# Altium project Inverter.PrjPcb
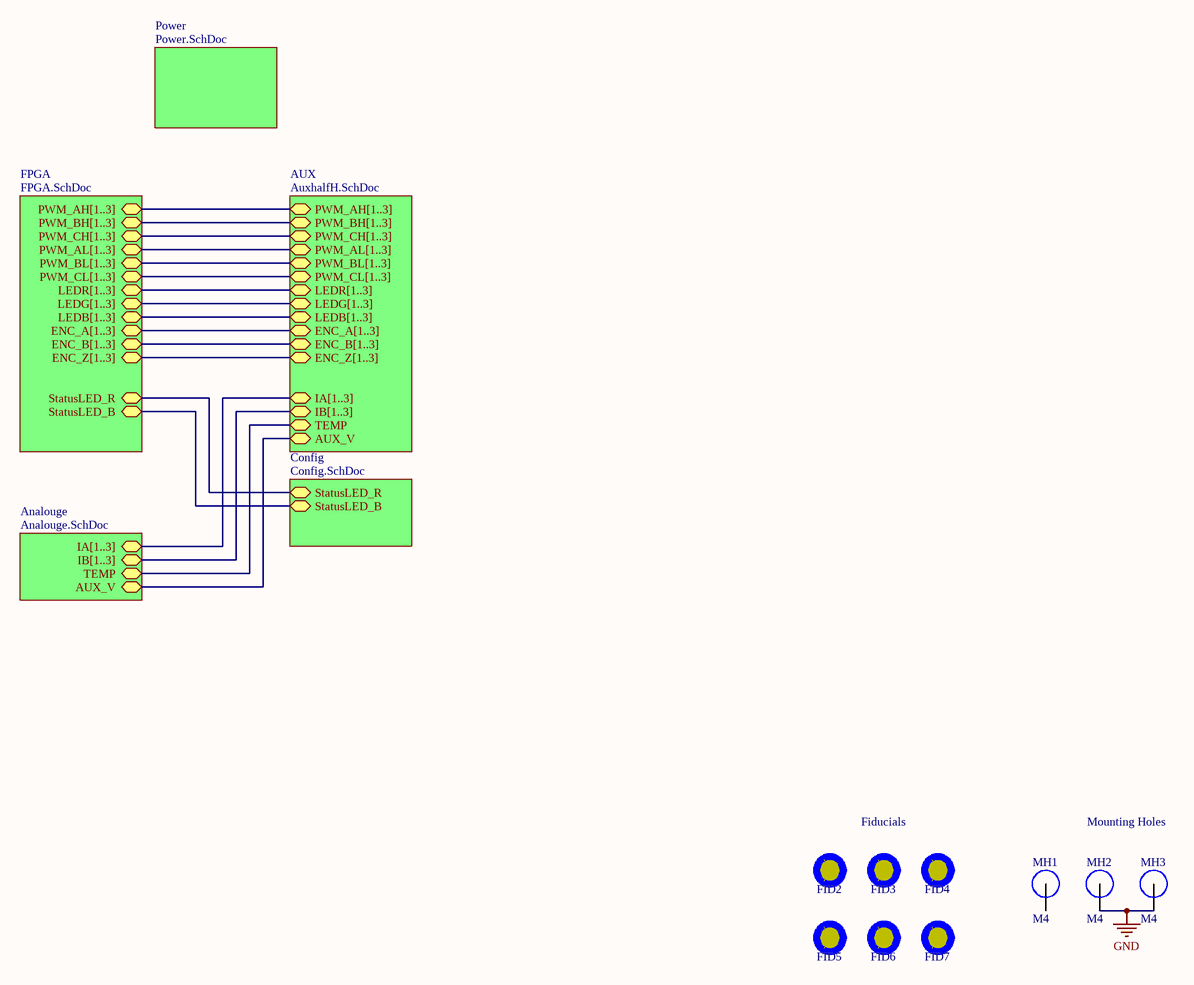
[diagram p0: Top.SchDoc]
7 sheets, 301 parts. Net scope: hierarchical (ports join the sheet entries above them; power ports are global).
Board file: Inverter.PcbDoc
Sheets:
  Top.SchDoc
    AUX = AuxhalfH.SchDoc
      M1 = M0.SchDoc
      M2 = M0.SchDoc
      M3 = M0.SchDoc
    Analouge = Analouge.SchDoc
    FPGA = FPGA.SchDoc
    Config = Config.SchDoc
    Power = Power.SchDoc

## Sheet Top.SchDoc
size A3

### Parts
FID2  FIDUCIAL  [FIDUCIAL]  (value not drawn)
FID3  FIDUCIAL  [FIDUCIAL]  (value not drawn)
FID4  FIDUCIAL  [FIDUCIAL]  (value not drawn)
FID5  FIDUCIAL  [FIDUCIAL]  (value not drawn)
FID6  FIDUCIAL  [FIDUCIAL]  (value not drawn)
FID7  FIDUCIAL  [FIDUCIAL]  (value not drawn)
MH1  M4  [MH_M4]
MH2  M4  [MH_M4]
MH3  M4  [MH_M4]

### Sub-sheets
Analouge = Analouge.SchDoc: AUX_V, IA[1..3], IB[1..3], TEMP
AUX = AuxhalfH.SchDoc: PWM_AH[1..3], PWM_BH[1..3], PWM_CH[1..3], PWM_AL[1..3], PWM_BL[1..3], PWM_CL[1..3], LEDR[1..3], LEDG[1..3], LEDB[1..3], ENC_A[1..3], ENC_B[1..3], ENC_Z[1..3], IA[1..3], IB[1..3], AUX_V, TEMP
Config = Config.SchDoc: StatusLED_B, StatusLED_R
FPGA = FPGA.SchDoc: PWM_AH[1..3], PWM_BH[1..3], PWM_CH[1..3], PWM_AL[1..3], PWM_BL[1..3], PWM_CL[1..3], LEDR[1..3], LEDG[1..3], LEDB[1..3], ENC_A[1..3], ENC_B[1..3], ENC_Z[1..3], StatusLED_B, StatusLED_R
Power = Power.SchDoc: no entries

### Nets
GND: MH2.1 MH3.1
StatusLED_B: sheet FPGA/StatusLED_B, sheet Config/StatusLED_B
StatusLED_R: sheet FPGA/StatusLED_R, sheet Config/StatusLED_R
NetR18_1: sheet AUX/AUX_V, sheet Analouge/AUX_V
NetR19_1: sheet AUX/TEMP, sheet Analouge/TEMP

Not connected (* = marked no-connect by the designer): MH1 1

### Buses and harness runs
bus sheet Analouge/IA[1..3] = sheet AUX/IA[1..3]
bus sheet Analouge/IB[1..3] = sheet AUX/IB[1..3]
bus sheet AUX/ENC_A[1..3] = sheet FPGA/ENC_A[1..3]
bus sheet AUX/ENC_B[1..3] = sheet FPGA/ENC_B[1..3]
bus sheet AUX/ENC_Z[1..3] = sheet FPGA/ENC_Z[1..3]
bus sheet AUX/LEDB[1..3] = sheet FPGA/LEDB[1..3]
bus sheet AUX/LEDG[1..3] = sheet FPGA/LEDG[1..3]
bus sheet AUX/LEDR[1..3] = sheet FPGA/LEDR[1..3]
bus sheet AUX/PWM_AH[1..3] = sheet FPGA/PWM_AH[1..3]
bus sheet AUX/PWM_AL[1..3] = sheet FPGA/PWM_AL[1..3]
bus sheet AUX/PWM_BH[1..3] = sheet FPGA/PWM_BH[1..3]
bus sheet AUX/PWM_BL[1..3] = sheet FPGA/PWM_BL[1..3]
bus sheet AUX/PWM_CH[1..3] = sheet FPGA/PWM_CH[1..3]
bus sheet AUX/PWM_CL[1..3] = sheet FPGA/PWM_CL[1..3]

### Notes on the sheet
- Fiducials
- Mounting Holes

### Library data of the parts
FID2-FID7 = FIDUCIAL: 1mm Fiducial with 2mm soldermask, 3mm keepout
MH1-MH3 = MH_M4: M4 Mounting Hole

## Sheet AuxhalfH.SchDoc
size A3; DocumentNumber: 4; SheetNumber: 4; SheetTotal: 8
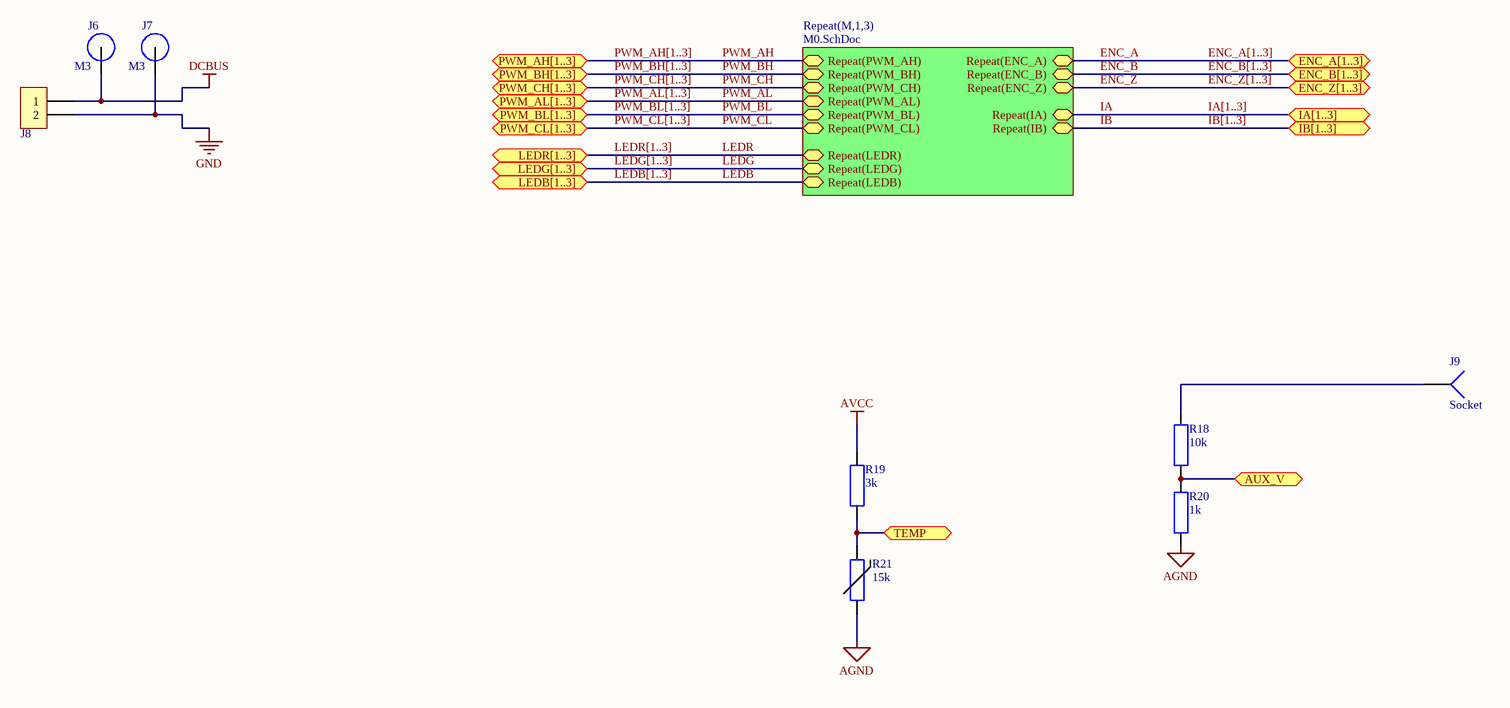
[diagram p1: AuxhalfH.SchDoc]

### Parts
J6  M3  [M3 Spade Hole]
J7  M3  [M3 Spade Hole]
J8  MC000232  [MC000232]  (value not drawn)
J9  Socket  [PIN1]
R18  value 10k  [RESC1608X06L]  (hidden comment: MCMR06X1002FTL)
R19  value 3k  [RESC1608X55N]  (hidden comment: MCMR06X3001FTL)
R20  value 1k  [RESC1608X55N]  (hidden comment: MCMR06X1001FTL)
R21  value 15k  [RESC1608X06L]  (hidden comment: NTCS0603E3153JMT)

### Sub-sheets
Repeat(M,1,3) = M0.SchDoc: Repeat(PWM_CH), Repeat(PWM_BH), Repeat(ENC_A), Repeat(PWM_AH), Repeat(ENC_B), Repeat(PWM_CL), Repeat(ENC_Z), Repeat(PWM_BL), Repeat(PWM_AL), Repeat(IA), Repeat(IB), Repeat(LEDR), Repeat(LEDG), Repeat(LEDB)

### Ports
AUX_V, ENC_A[1..3], ENC_B[1..3], ENC_Z[1..3], IA[1..3], IB[1..3], LEDB[1..3], LEDG[1..3], LEDR[1..3], PWM_AH[1..3], PWM_AL[1..3], PWM_BH[1..3], PWM_BL[1..3], PWM_CH[1..3], PWM_CL[1..3], TEMP

### Nets
AGND: R20.1 R21.1
AVCC: R19.2
DCBUS: J6.1 J8.1
GND: J7.1 J8.2
ENC_A: sheet Repeat(M,1,3)/Repeat(ENC_A)
ENC_B: sheet Repeat(M,1,3)/Repeat(ENC_B)
ENC_Z: sheet Repeat(M,1,3)/Repeat(ENC_Z)
IA: sheet Repeat(M,1,3)/Repeat(IA)
IB: sheet Repeat(M,1,3)/Repeat(IB)
LEDB: sheet Repeat(M,1,3)/Repeat(LEDB)
LEDG: sheet Repeat(M,1,3)/Repeat(LEDG)
LEDR: sheet Repeat(M,1,3)/Repeat(LEDR)
PWM_AH: sheet Repeat(M,1,3)/Repeat(PWM_AH)
PWM_AL: sheet Repeat(M,1,3)/Repeat(PWM_AL)
PWM_BH: sheet Repeat(M,1,3)/Repeat(PWM_BH)
PWM_BL: sheet Repeat(M,1,3)/Repeat(PWM_BL)
PWM_CH: sheet Repeat(M,1,3)/Repeat(PWM_CH)
PWM_CL: sheet Repeat(M,1,3)/Repeat(PWM_CL)
NetJ9_1: J9.1 R18.2
NetR18_1: R18.1 R20.2 ; port AUX_V
NetR19_1: R19.1 R21.2 ; port TEMP

### Buses and harness runs
bus ENC_A[1..3] = port ENC_A[1..3]
bus ENC_B[1..3] = port ENC_B[1..3]
bus ENC_Z[1..3] = port ENC_Z[1..3]
bus IA[1..3] = port IA[1..3]
bus IB[1..3] = port IB[1..3]
bus LEDB[1..3] = port LEDB[1..3]
bus LEDG[1..3] = port LEDG[1..3]
bus LEDR[1..3] = port LEDR[1..3]
bus PWM_AH[1..3] = port PWM_AH[1..3]
bus PWM_AL[1..3] = port PWM_AL[1..3]
bus PWM_BH[1..3] = port PWM_BH[1..3]
bus PWM_BL[1..3] = port PWM_BL[1..3]
bus PWM_CH[1..3] = port PWM_CH[1..3]
bus PWM_CL[1..3] = port PWM_CL[1..3]

### Library data of the parts
J6 J7 = M3 Spade Terminal
J8 = MC000232: TERMINAL BLOCK, WIRE TO BRD, 2POS, 6AWG; Supplier 1: Farnell; Supplier Part Number 1: 2008224
R18 = MCMR06X1002FTL: Resistor, 10k, 0603; Supplier 1: Farnell; Supplier Part Number 1: 2073349; Supplier 2: Farnell; Supplier Part Number 2: 2073349RL
R19 = MCMR06X3001FTL: RESISTOR, 0603, 3K, 1%, ANTI SULFUR; Supplier 1: Farnell; Supplier Part Number 1: 2073461; Supplier 2: Farnell; Supplier Part Number 2: 2073461RL
R20 = MCMR06X1001FTL: RESISTOR, CERAMIC, 1K, 0.1W, 1%; Supplier 1: Farnell; Supplier Part Number 1: 2073348; Supplier 2: Farnell; Supplier Part Number 2: 2073348RL
R21 = NTCS0603E3153JMT: THERMISTOR, 15K, 5%, SMD, NTC
J9 = Socket: LatestRevisionDate: 17-Jul-2002; LatestRevisionNote: Re-released for DXP Platform.; Publisher: Altium Limited

## Sheet M0.SchDoc
size A3; DocumentNumber: 1; SheetNumber: 1; SheetTotal: 8
Used 3 times, as channels AUX/M1, AUX/M2, AUX/M3. Parts and nets are listed once, with the designators drawn on the sheet.
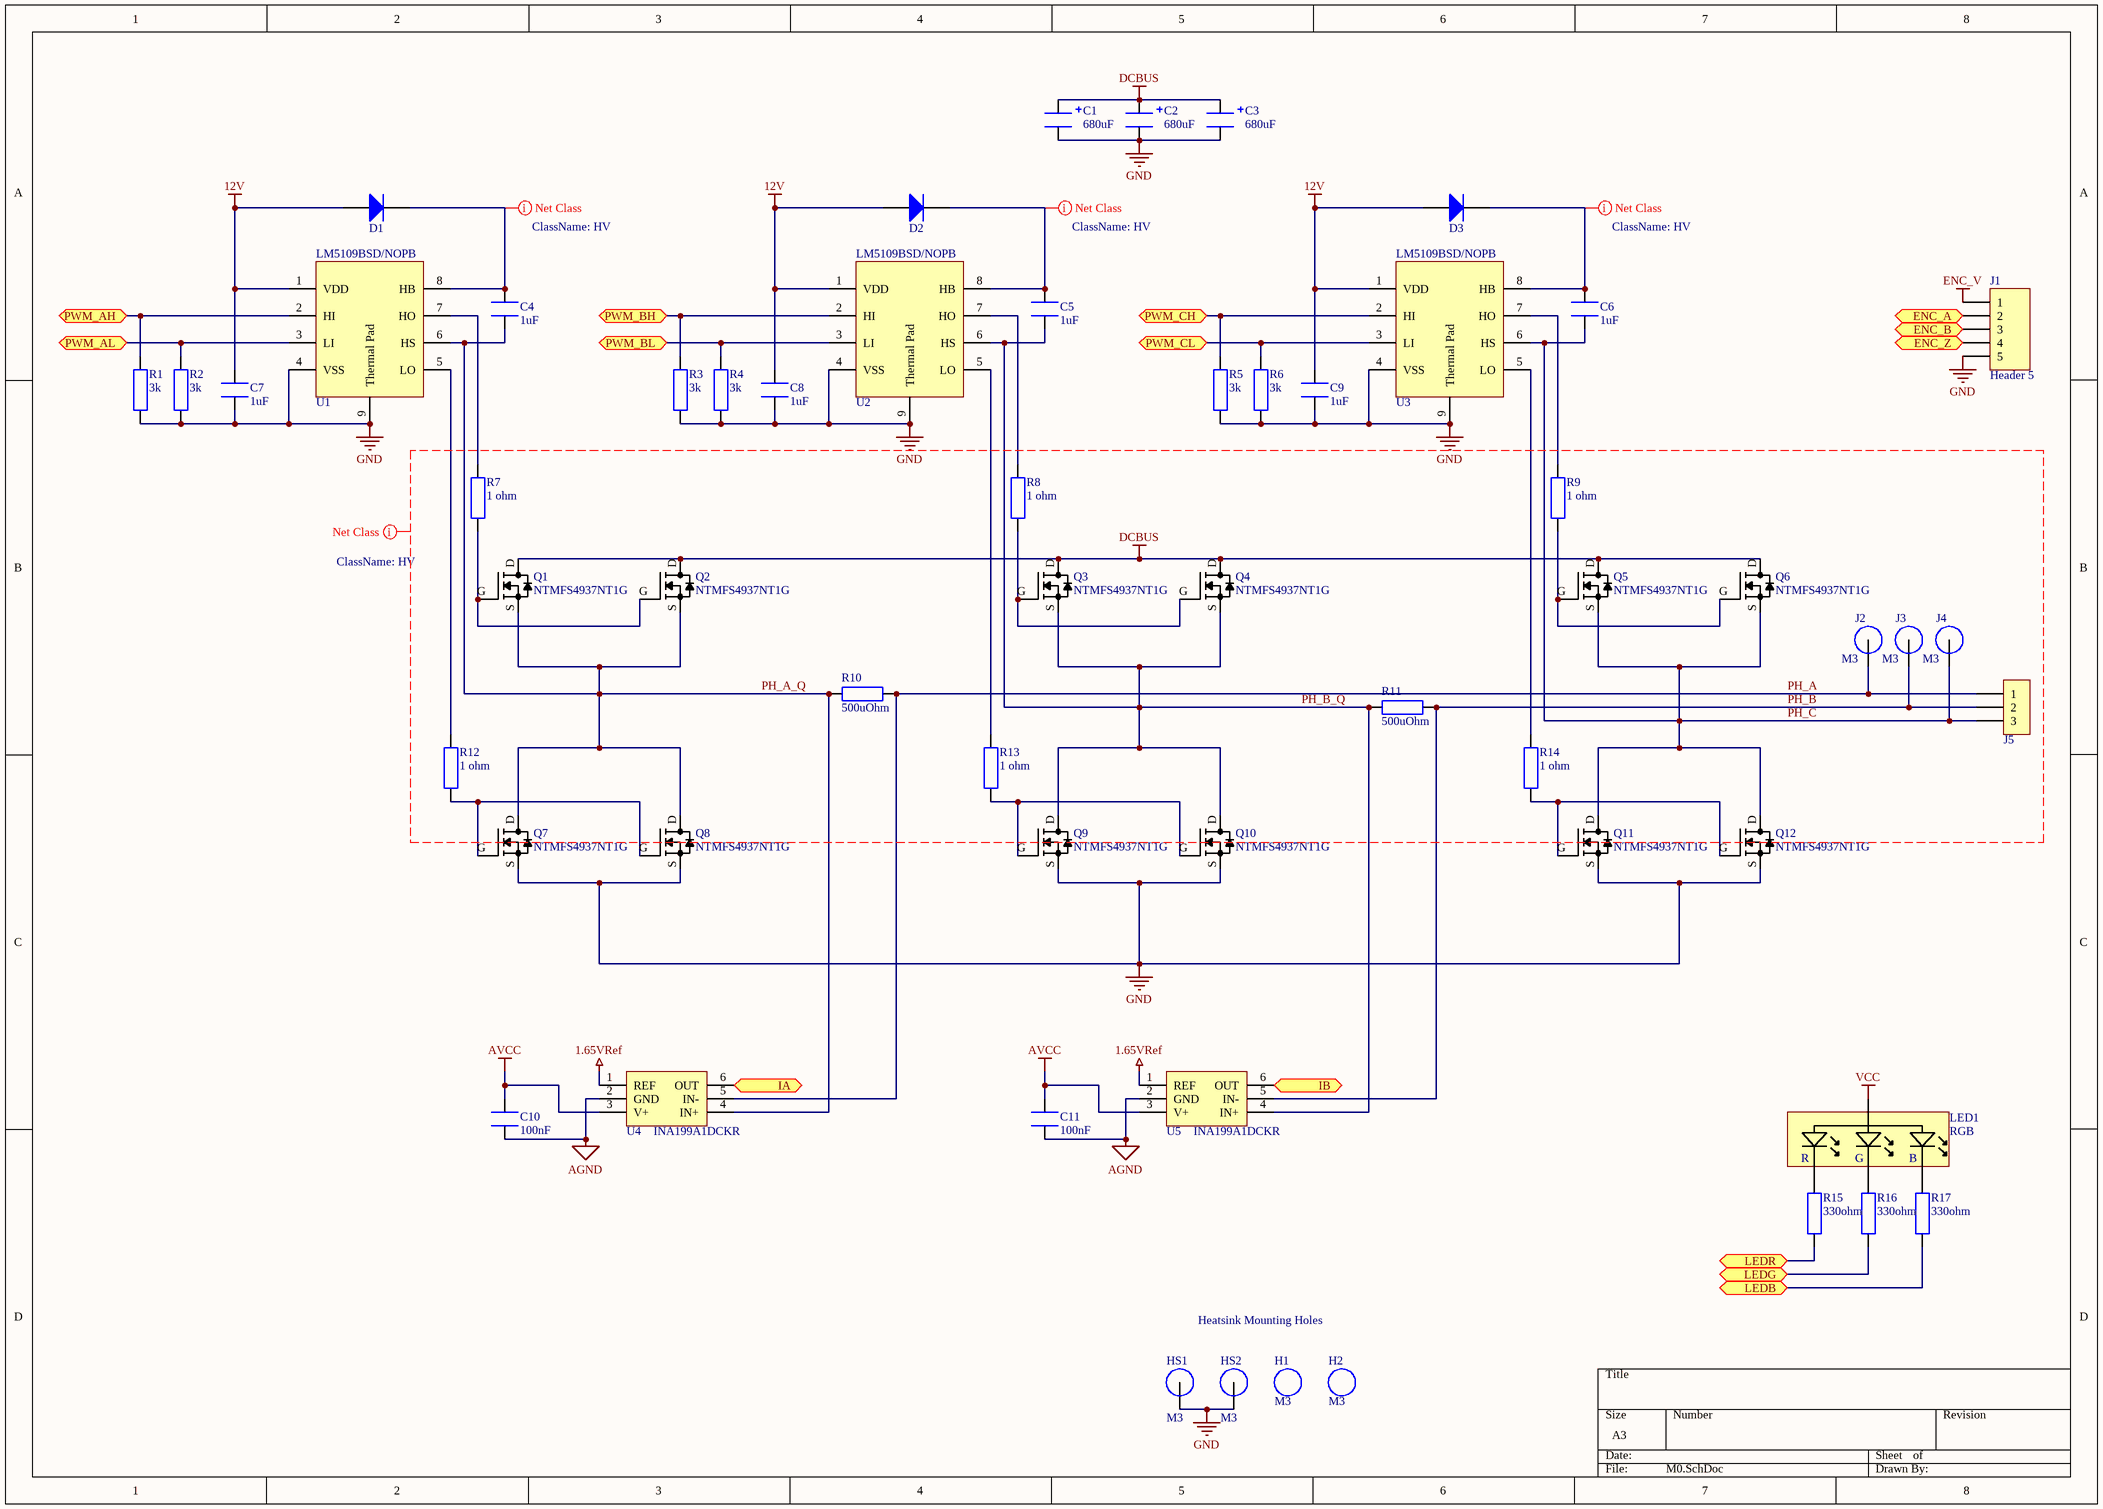
[diagram p2: M0.SchDoc]

### Parts
C1  value 680uF  [CAPE10.0MM_Rad_10x14mm]  (hidden comment: 35ZLH680MEFC10X23)
C2  value 680uF  [CAPE10.0MM_Rad_10x14mm]  (hidden comment: 35ZLH680MEFC10X23)
C3  value 680uF  [CAPE10.0MM_Rad_10x14mm]  (hidden comment: 35ZLH680MEFC10X23)
C4  value 1uF  [1608[0603]]  (hidden comment: MC0603X105K160)
C5  value 1uF  [1608[0603]]  (hidden comment: MC0603X105K160)
C6  value 1uF  [1608[0603]]  (hidden comment: MC0603X105K160)
C7  value 1uF  [1608[0603]]  (hidden comment: MC0603X105K160)
C8  value 1uF  [1608[0603]]  (hidden comment: MC0603X105K160)
C9  value 1uF  [1608[0603]]  (hidden comment: MC0603X105K160)
C10  value 100nF  [1608[0603]]  (hidden comment: MC0603B104K160CT)
C11  value 100nF  [1608[0603]]  (hidden comment: MC0603B104K160CT)
D1  RB521S30T1G  [SOD523F]  (value not drawn)
D2  RB521S30T1G  [SOD523F]  (value not drawn)
D3  RB521S30T1G  [SOD523F]  (value not drawn)
H1  M3  [M3 Hole]
H2  M3  [M3 Hole]
HS1  M3  [M3 Mounting Hole]
HS2  M3  [M3 Mounting Hole]
J1  Header 5  [HDR1X5]
J2  M3  [M3 Spade Hole]
J3  M3  [M3 Spade Hole]
J4  M3  [M3 Spade Hole]
J5  MC000051  [MC000051]  (value not drawn)
LED1  RGB  [ASMB-MTB1]
Q1  NTMFS4937NT1G  [SO8FL_FILL]
Q2  NTMFS4937NT1G  [SO8FL_FILL]
Q3  NTMFS4937NT1G  [SO8FL_FILL]
Q4  NTMFS4937NT1G  [SO8FL_FILL]
Q5  NTMFS4937NT1G  [SO8FL_FILL]
Q6  NTMFS4937NT1G  [SO8FL_FILL]
Q7  NTMFS4937NT1G  [SO8FL_FILL]
Q8  NTMFS4937NT1G  [SO8FL_FILL]
Q9  NTMFS4937NT1G  [SO8FL_FILL]
Q10  NTMFS4937NT1G  [SO8FL_FILL]
Q11  NTMFS4937NT1G  [SO8FL_FILL]
Q12  NTMFS4937NT1G  [SO8FL_FILL]
R1  value 3k  [RESC1608X55N]  (hidden comment: MCMR06X3001FTL)
R2  value 3k  [RESC1608X55N]  (hidden comment: MCMR06X3001FTL)
R3  value 3k  [RESC1608X55N]  (hidden comment: MCMR06X3001FTL)
R4  value 3k  [RESC1608X55N]  (hidden comment: MCMR06X3001FTL)
R5  value 3k  [RESC1608X55N]  (hidden comment: MCMR06X3001FTL)
R6  value 3k  [RESC1608X55N]  (hidden comment: MCMR06X3001FTL)
R7  value 1 ohm  [RESC1608X55N]  (hidden comment: MCWR06W1R00FTL)
R8  value 1 ohm  [RESC1608X55N]  (hidden comment: MCWR06W1R00FTL)
R9  value 1 ohm  [RESC1608X55N]  (hidden comment: MCWR06W1R00FTL)
R10  value 500uOhm  [RESC6332X70N]  (hidden comment: TLR3A20DR0005FTDG)
R11  value 500uOhm  [RESC6332X70N]  (hidden comment: TLR3A20DR0005FTDG)
R12  value 1 ohm  [RESC1608X55N]  (hidden comment: MCWR06W1R00FTL)
R13  value 1 ohm  [RESC1608X55N]  (hidden comment: MCWR06W1R00FTL)
R14  value 1 ohm  [RESC1608X55N]  (hidden comment: MCWR06W1R00FTL)
R15  value 330ohm  [RESC1608X06L]  (hidden comment: MCWR06X3300FTL)
R16  value 330ohm  [RESC1608X06L]  (hidden comment: MCWR06X3300FTL)
R17  value 330ohm  [RESC1608X06L]  (hidden comment: MCWR06X3300FTL)
U1  LM5109BSD/NOPB  [SON80P400X80_HS-9N]
U2  LM5109BSD/NOPB  [SON80P400X80_HS-9N]
U3  LM5109BSD/NOPB  [SON80P400X80_HS-9N]
U4  INA199A1DCKR  [TSOP65P210X110-6N]
U5  INA199A1DCKR  [TSOP65P210X110-6N]

### Ports
ENC_A, ENC_B, ENC_Z, IA, IB, LEDB, LEDG, LEDR, PWM_AH, PWM_AL, PWM_BH, PWM_BL, PWM_CH, PWM_CL

### Nets
1.65VRef: U4.1(REF) U5.1(REF)
12V: C7.2 C8.2 C9.2 D1.A D2.A D3.A U1.1(VDD) U2.1(VDD) U3.1(VDD)
AGND: C10.1 C11.1 U4.2(GND) U5.2(GND)
AVCC: C10.2 C11.2 U4.3(V+) U5.3(V+)
DCBUS: C1.1 C2.1 C3.1 Q1.D Q2.D Q3.D Q4.D Q5.D Q6.D
ENC_V: J1.1
GND: C1.2 C2.2 C3.2 C7.1 C8.1 C9.1 HS1.1 HS2.1 J1.5 Q7.S Q8.S Q9.S Q10.S Q11.S Q12.S R1.1 R2.1 R3.1 R4.1 R5.1 R6.1 U1.4(VSS) U1.9(Thermal_Pad) U2.4(VSS) U2.9(Thermal_Pad) U3.4(VSS) U3.9(Thermal_Pad)
VCC: LED1.4(A)
ENC_A: J1.2 ; port ENC_A
ENC_B: J1.3 ; port ENC_B
ENC_Z: J1.4 ; port ENC_Z
IA: U4.6(OUT) ; port IA
IB: U5.6(OUT) ; port IB
LEDB: R17.2 ; port LEDB
LEDG: R16.2 ; port LEDG
LEDR: R15.2 ; port LEDR
PH_A: J2.1 J5.1 R10.1 U4.5(IN-)
PH_A_Q: C4.1 Q1.S Q2.S Q7.D Q8.D R10.2 U1.6(HS) U4.4(IN+)
PH_B: J3.1 J5.2 R11.1 U5.5(IN-)
PH_B_Q: C5.1 Q3.S Q4.S Q9.D Q10.D R11.2 U2.6(HS) U5.4(IN+)
PH_C: C6.1 J4.1 J5.3 Q5.S Q6.S Q11.D Q12.D U3.6(HS)
PWM_AH: R1.2 U1.2(HI) ; port PWM_AH
PWM_AL: R2.2 U1.3(LI) ; port PWM_AL
PWM_BH: R3.2 U2.2(HI) ; port PWM_BH
PWM_BL: R4.2 U2.3(LI) ; port PWM_BL
PWM_CH: R5.2 U3.2(HI) ; port PWM_CH
PWM_CL: R6.2 U3.3(LI) ; port PWM_CL
NetC4_2: C4.2 D1.K U1.8(HB)
NetC5_2: C5.2 D2.K U2.8(HB)
NetC6_2: C6.2 D3.K U3.8(HB)
NetLED1_1: LED1.1(R) R15.1
NetLED1_2: LED1.2(G) R16.1
NetLED1_3: LED1.3(B) R17.1
NetQ1_G: Q1.G Q2.G R7.1
NetQ3_G: Q3.G Q4.G R8.1
NetQ5_G: Q5.G Q6.G R9.1
NetQ7_G: Q7.G Q8.G R12.1
NetQ9_G: Q9.G Q10.G R13.1
NetQ11_G: Q11.G Q12.G R14.1
NetR7_2: R7.2 U1.7(HO)
NetR8_2: R8.2 U2.7(HO)
NetR9_2: R9.2 U3.7(HO)
NetR12_2: R12.2 U1.5(LO)
NetR13_2: R13.2 U2.5(LO)
NetR14_2: R14.2 U3.5(LO)

### Channels
AUX/M1: designators C1=1C1 C2=1C2 C3=1C3 C4=1C4 C5=1C5 C6=1C6 C7=1C7 C8=1C8 C9=1C9 C10=1C10 C11=1C11 D1=1D1 D2=1D2 D3=1D3 H1=1H1 H2=1H2 HS1=1HS1 HS2=1HS2 J1=1J1 J2=1A J3=1B J4=1C J5=1J5 LED1=1LED1 Q1=1Q1 Q2=1Q2 Q3=1Q3 Q4=1Q4 Q5=1Q5 Q6=1Q6 Q7=1Q7 Q8=1Q8 Q9=1Q9 Q10=1Q10 Q11=1Q11 Q12=1Q12 R1=1R1 R2=1R2 R3=1R3 R4=1R4 R5=1R5 R6=1R6 R7=1R7 R8=1R8 R9=1R9 R10=1R10 R11=1R11 R12=1R12 R13=1R13 R14=1R14 R15=1R15 R16=1R16 R17=1R17 U1=1U1 U2=1U2 U3=1U3 U4=1U4 U5=1U5; ports ENC_A=ENC_A1 ENC_B=ENC_B1 ENC_Z=ENC_Z1 IA=IA1 IB=IB1 LEDB=LEDB1 LEDG=LEDG1 LEDR=LEDR1 PWM_AH=PWM_AH1 PWM_AL=PWM_AL1 PWM_BH=PWM_BH1 PWM_BL=PWM_BL1 PWM_CH=PWM_CH1 PWM_CL=PWM_CL1
AUX/M2: designators C1=2C1 C2=2C2 C3=2C3 C4=2C4 C5=2C5 C6=2C6 C7=2C7 C8=2C8 C9=2C9 C10=2C10 C11=2C11 D1=2D1 D2=2D2 D3=2D3 H1=2H1 H2=2H2 HS1=2HS1 HS2=2HS2 J1=2J1 J2=2A J3=2B J4=2C J5=2J5 LED1=2LED1 Q1=2Q1 Q2=2Q2 Q3=2Q3 Q4=2Q4 Q5=2Q5 Q6=2Q6 Q7=2Q7 Q8=2Q8 Q9=2Q9 Q10=2Q10 Q11=2Q11 Q12=2Q12 R1=2R1 R2=2R2 R3=2R3 R4=2R4 R5=2R5 R6=2R6 R7=2R7 R8=2R8 R9=2R9 R10=2R10 R11=2R11 R12=2R12 R13=2R13 R14=2R14 R15=2R15 R16=2R16 R17=2R17 U1=2U1 U2=2U2 U3=2U3 U4=2U4 U5=2U5; ports ENC_A=ENC_A2 ENC_B=ENC_B2 ENC_Z=ENC_Z2 IA=IA2 IB=IB2 LEDB=LEDB2 LEDG=LEDG2 LEDR=LEDR2 PWM_AH=PWM_AH2 PWM_AL=PWM_AL2 PWM_BH=PWM_BH2 PWM_BL=PWM_BL2 PWM_CH=PWM_CH2 PWM_CL=PWM_CL2
AUX/M3: designators C1=3C1 C2=3C2 C3=3C3 C4=3C4 C5=3C5 C6=3C6 C7=3C7 C8=3C8 C9=3C9 C10=3C10 C11=3C11 D1=3D1 D2=3D2 D3=3D3 H1=3H1 H2=3H2 HS1=3HS1 HS2=3HS2 J1=3J1 J2=3A J3=3B J4=3C J5=3J5 LED1=3LED1 Q1=3Q1 Q2=3Q2 Q3=3Q3 Q4=3Q4 Q5=3Q5 Q6=3Q6 Q7=3Q7 Q8=3Q8 Q9=3Q9 Q10=3Q10 Q11=3Q11 Q12=3Q12 R1=3R1 R2=3R2 R3=3R3 R4=3R4 R5=3R5 R6=3R6 R7=3R7 R8=3R8 R9=3R9 R10=3R10 R11=3R11 R12=3R12 R13=3R13 R14=3R14 R15=3R15 R16=3R16 R17=3R17 U1=3U1 U2=3U2 U3=3U3 U4=3U4 U5=3U5; ports ENC_A=ENC_A3 ENC_B=ENC_B3 ENC_Z=ENC_Z3 IA=IA3 IB=IB3 LEDB=LEDB3 LEDG=LEDG3 LEDR=LEDR3 PWM_AH=PWM_AH3 PWM_AL=PWM_AL3 PWM_BH=PWM_BH3 PWM_BL=PWM_BL3 PWM_CH=PWM_CH3 PWM_CL=PWM_CL3

### Layout directives
net class HV: DCBUS, Net1C4_2, Net1C5_2, Net1C6_2, PH_A, PH_A_Q, PH_B, PH_B_Q, PH_C

### Notes on the sheet
- Heatsink Mounting Holes

### Library data of the parts
C1-C3 = 35ZLH680MEFC10X23: CAP, ALU ELEC, 680UF, 35V, RAD; Supplier 1: Farnell; Supplier Part Number 1: 8126771
C4-C9 = MC0603X105K160: CAP, MLCC, X5R, 1UF, 16V, 0603; Supplier 1: Farnell; Supplier Part Number 1: 2310630; Supplier 2: Farnell; Supplier Part Number 2: 1759407RL; Supplier 3: Farnell; Supplier Part Number 3: 1759407
C10 C11 = MC0603B104K160CT: CAP, MLCC, X7R, 100NF, 16V, 0603; Supplier 1: Farnell; Supplier Part Number 1: 2310628; Supplier 2: Farnell; Supplier Part Number 2: 1759016RL; Supplier 3: Farnell; Supplier Part Number 3: 1759016
D1-D3 = RB521S30T1G: DIODE, SCHOTTKY, 200MA, 30V; Supplier 1: Farnell; Supplier Part Number 1: 2317433
H1 H2 = M3 Hole: M3 Hole with no copper
HS1 HS2 = M3 Mounting Hole
J1 = Header 5: Header, 5-Pin; LatestRevisionDate: 17-Jul-2002; LatestRevisionNote: Re-released for DXP Platform.; Publisher: Altium Limited
J2-J4 = M3 Spade Terminal
J5 = MC000051: TERMINAL BLOCK, WIRE TO BRD, 3POS, 10AWG; Supplier 1: Farnell; Supplier Part Number 1: 2008022
LED1 = ASMB-MTB1-0A3A2: LED, HB, RGB, 0.09W, PLCC-4; Supplier 1: Farnell; Supplier Part Number 1: 2401106
Q1-Q12 = NTMFS4937NT1G: MOSFET, N CH, 30V, 70A, SO-8 FL; Supplier 1: Farnell; Supplier Part Number 1: 2317605; Supplier 2: Farnell; Supplier Part Number 2: 2317605RL
R1-R6 = MCMR06X3001FTL: RESISTOR, 0603, 3K, 1%, ANTI SULFUR; Supplier 1: Farnell; Supplier Part Number 1: 2073461; Supplier 2: Farnell; Supplier Part Number 2: 2073461RL
R7-R9 R12-R14 = MCWR06W1R00FTL: RES, THICK FILM, 1OHM, 1%, 0.1W; Supplier 1: Farnell; Supplier 2: Farnell; Supplier Part Number 1: 2447289; Supplier Part Number 2: 2447289RL
R10 R11 = TLR3A20DR0005FTDG: RESISTOR, R0005, 2.0W, 1%
R15-R17 = MCWR06X3300FTL: RES, THICK FILM, 330 OHM, 1%, 0.1W; Supplier 1: Farnell; Supplier Part Number 1: 2447339RL; Supplier 2: Farnell; Supplier Part Number 2: 2446656; Supplier 3: Farnell; Supplier Part Number 3: 2447339
U1-U3 = LM5109BSD/NOPB: DRIVER, MOSFET, HALF BRIDGE, WSON-8, 1A; Supplier 1: Farnell; Supplier Part Number 1: 2400642RL; Supplier 2: Farnell; Supplier Part Number 2: 2400642; Supplier 3: Farnell; Supplier Part Number 3: 2382850
U4 U5 = INA199A1DCKR: CURRENT SENSE AMP, 50V/V, 80KHZ; Supplier 1: Digi-Key; Supplier Part Number 1: 296-27329-1-ND; Supplier 2: Mouser; Supplier Part Number 2: 595-INA199B1DCKT

## Sheet Analouge.SchDoc
size A3; DocumentNumber: 5; SheetNumber: 5; SheetTotal: 8
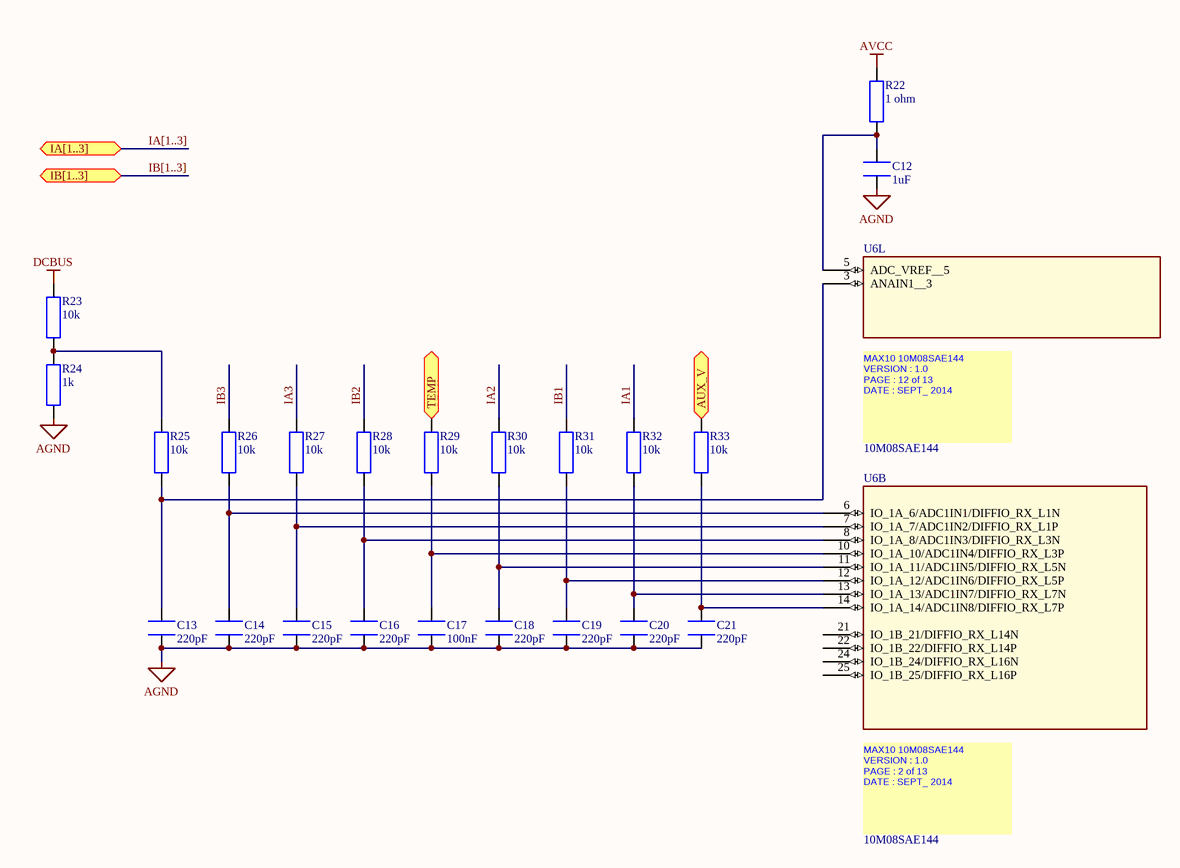
[diagram p3: Analouge.SchDoc]

### Parts
C12  value 1uF  [1608[0603]]  (hidden comment: MC0603X105K160)
C13  value 220pF  [1608[0603]]  (hidden comment: MC0603N221J500CT)
C14  value 220pF  [1608[0603]]  (hidden comment: MC0603N221J500CT)
C15  value 220pF  [1608[0603]]  (hidden comment: MC0603N221J500CT)
C16  value 220pF  [1608[0603]]  (hidden comment: MC0603N221J500CT)
C17  value 100nF  [1608[0603]]  (hidden comment: MC0603B104K160CT)
C18  value 220pF  [1608[0603]]  (hidden comment: MC0603N221J500CT)
C19  value 220pF  [1608[0603]]  (hidden comment: MC0603N221J500CT)
C20  value 220pF  [1608[0603]]  (hidden comment: MC0603N221J500CT)
C21  value 220pF  [1608[0603]]  (hidden comment: MC0603N221J500CT)
R22  value 1 ohm  [RESC1608X55N]  (hidden comment: MCWR06W1R00FTL)
R23  value 10k  [RESC1608X06L]  (hidden comment: MCMR06X1002FTL)
R24  value 1k  [RESC1608X55N]  (hidden comment: MCMR06X1001FTL)
R25  value 10k  [RESC1608X06L]  (hidden comment: MCMR06X1002FTL)
R26  value 10k  [RESC1608X06L]  (hidden comment: MCMR06X1002FTL)
R27  value 10k  [RESC1608X06L]  (hidden comment: MCMR06X1002FTL)
R28  value 10k  [RESC1608X06L]  (hidden comment: MCMR06X1002FTL)
R29  value 10k  [RESC1608X06L]  (hidden comment: MCMR06X1002FTL)
R30  value 10k  [RESC1608X06L]  (hidden comment: MCMR06X1002FTL)
R31  value 10k  [RESC1608X06L]  (hidden comment: MCMR06X1002FTL)
R32  value 10k  [RESC1608X06L]  (hidden comment: MCMR06X1002FTL)
R33  value 10k  [RESC1608X06L]  (hidden comment: MCMR06X1002FTL)
U6  10M08SAE144  [SQFP50P2200X2200X165_HS-145N]  (parts B,L of 13)

### Ports
AUX_V, IA[1..3], IB[1..3], TEMP

### Nets
AGND: C12.1 C13.1 C14.1 C15.1 C16.1 C17.1 C18.1 C19.1 C20.1 C21.1 R24.1
AVCC: R22.2
DCBUS: R23.2
IA1: R32.2
IA2: R30.2
IA3: R27.2
IB1: R31.2
IB2: R28.2
IB3: R26.2
NetC12_2: C12.2 R22.1 U6.5(ADC_VREF__5)
NetC13_2: C13.2 R25.1 U6.3(ANAIN1__3)
NetC14_2: C14.2 R26.1 U6.6(IO_1A_6/ADC1IN1/DIFFIO_RX_L1N)
NetC15_2: C15.2 R27.1 U6.7(IO_1A_7/ADC1IN2/DIFFIO_RX_L1P)
NetC16_2: C16.2 R28.1 U6.8(IO_1A_8/ADC1IN3/DIFFIO_RX_L3N)
NetC17_2: C17.2 R29.1 U6.10(IO_1A_10/ADC1IN4/DIFFIO_RX_L3P)
NetC18_2: C18.2 R30.1 U6.11(IO_1A_11/ADC1IN5/DIFFIO_RX_L5N)
NetC19_2: C19.2 R31.1 U6.12(IO_1A_12/ADC1IN6/DIFFIO_RX_L5P)
NetC20_2: C20.2 R32.1 U6.13(IO_1A_13/ADC1IN7/DIFFIO_RX_L7N)
NetC21_2: C21.2 R33.1 U6.14(IO_1A_14/ADC1IN8/DIFFIO_RX_L7P)
NetR18_1: R33.2 ; port AUX_V
NetR19_1: R29.2 ; port TEMP
NetR23_1: R23.1 R24.2 R25.2

Not connected (* = marked no-connect by the designer): U6 21(IO_1B_21/DIFFIO_RX_L14N) 22(IO_1B_22/DIFFIO_RX_L14P) 24(IO_1B_24/DIFFIO_RX_L16N) 25(IO_1B_25/DIFFIO_RX_L16P)

### Buses and harness runs
bus IA[1..3] = port IA[1..3]
bus IB[1..3] = port IB[1..3]

### Notes on the sheet
- (in symbol 10M08SAE144, part B) MAX10 10M08SAE144 / VERSION : 1.0 / PAGE : 2 of 13 / DATE : SEPT_ 2014 /
- (in symbol 10M08SAE144, part L) MAX10 10M08SAE144 / VERSION : 1.0 / PAGE : 12 of 13 / DATE : SEPT_ 2014 /

### Library data of the parts
C12 = MC0603X105K160: CAP, MLCC, X5R, 1UF, 16V, 0603; Supplier 1: Farnell; Supplier Part Number 1: 2310630; Supplier 2: Farnell; Supplier Part Number 2: 1759407RL; Supplier 3: Farnell; Supplier Part Number 3: 1759407
C13-C16 C18-C21 = MC0603N221J500CT: CAP, MLCC, C0G/NP0, 220PF, 50V, 0603; Supplier 1: Farnell; Supplier Part Number 1: 1759071RL; Supplier 2: Farnell; Supplier Part Number 2: 2310581; Supplier 3: Farnell; Supplier Part Number 3: 1759071
C17 = MC0603B104K160CT: CAP, MLCC, X7R, 100NF, 16V, 0603; Supplier 1: Farnell; Supplier Part Number 1: 2310628; Supplier 2: Farnell; Supplier Part Number 2: 1759016RL; Supplier 3: Farnell; Supplier Part Number 3: 1759016
R22 = MCWR06W1R00FTL: RES, THICK FILM, 1OHM, 1%, 0.1W; Supplier 1: Farnell; Supplier 2: Farnell; Supplier Part Number 1: 2447289; Supplier Part Number 2: 2447289RL
R23 R25-R33 = MCMR06X1002FTL: Resistor, 10k, 0603; Supplier 1: Farnell; Supplier Part Number 1: 2073349; Supplier 2: Farnell; Supplier Part Number 2: 2073349RL
R24 = MCMR06X1001FTL: RESISTOR, CERAMIC, 1K, 0.1W, 1%; Supplier 1: Farnell; Supplier Part Number 1: 2073348; Supplier 2: Farnell; Supplier Part Number 2: 2073348RL
U6 = 10M08SAE144: SWAP_INFO: (S1+S2+S3+S4+S5+S6+S7+S8+S9+S10+S11+S12+S13); SPLIT_INST: TRUE

## Sheet FPGA.SchDoc
size A3; DocumentNumber: 6; SheetNumber: 6; SheetTotal: 8
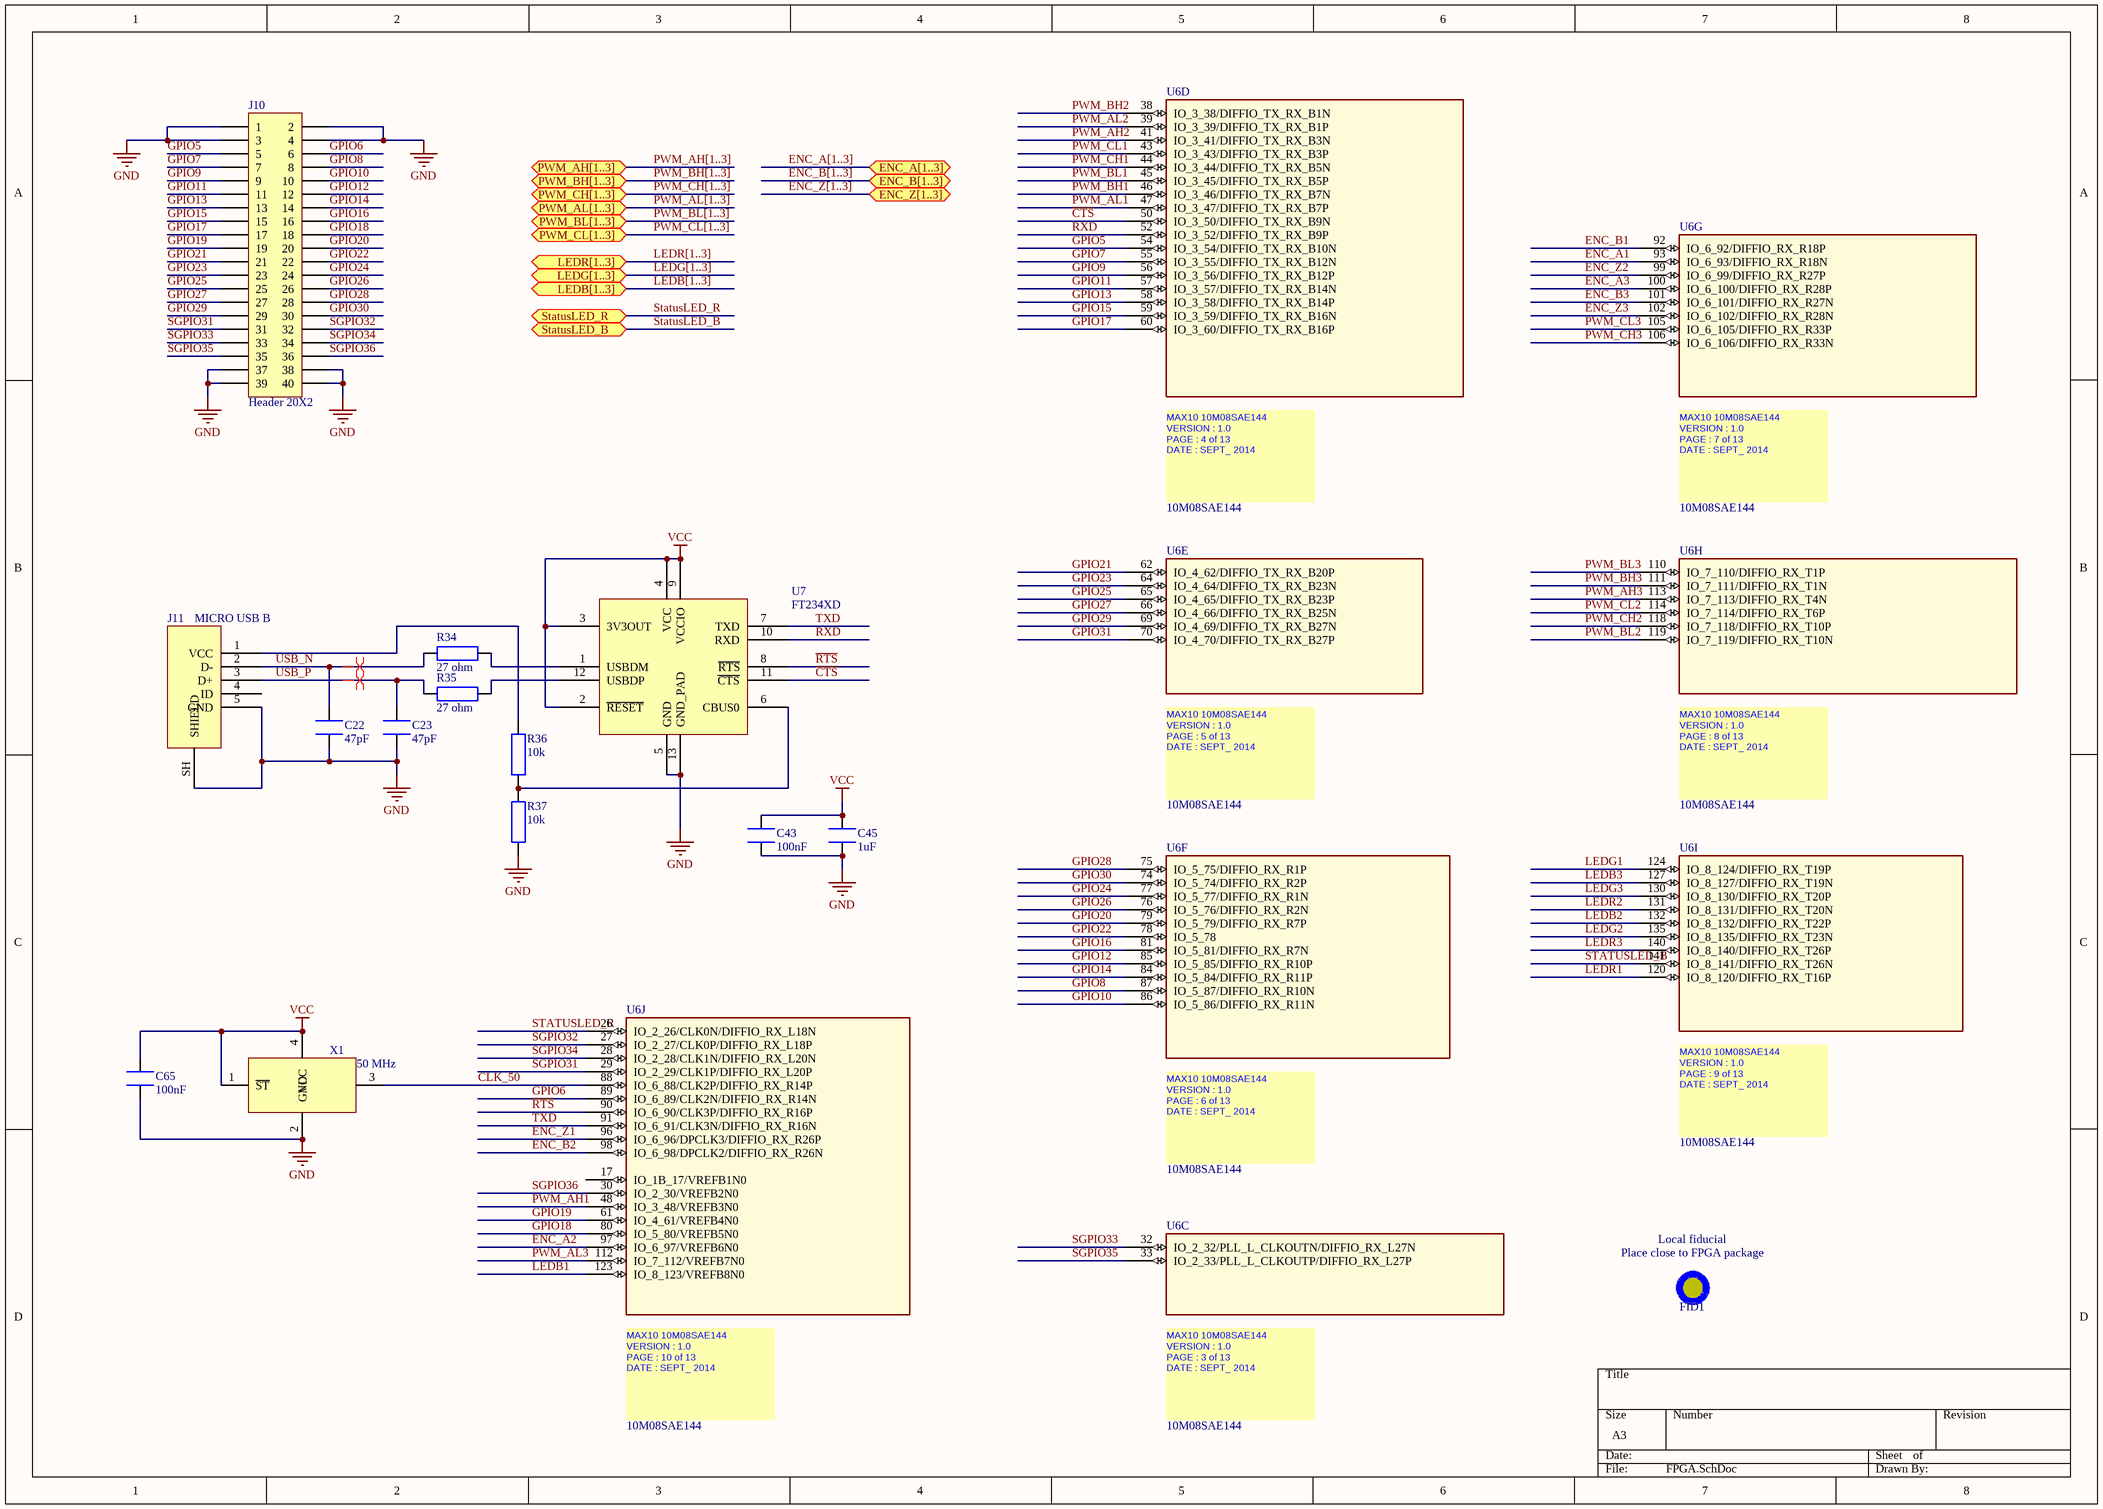
[diagram p4: FPGA.SchDoc]

### Parts
C22  value 47pF  [1608[0603]]  (hidden comment: MC0603N470J500CT)
C23  value 47pF  [1608[0603]]  (hidden comment: MC0603N470J500CT)
C43  value 100nF  [1608[0603]]  (hidden comment: MC0603B104K160CT)
C45  value 1uF  [1608[0603]]  (hidden comment: MC0603X105K160)
C65  value 100nF  [1608[0603]]  (hidden comment: MC0603B104K160CT)
FID1  FIDUCIAL  [FIDUCIAL]  (value not drawn)
J10  Header 20X2  [HDR2X20]
J11  MICRO USB B  [USB_0103594-0001LF]
R34  value 27 ohm  [RESC1608X55N]  (hidden comment: MCWR06X27R0FTL)
R35  value 27 ohm  [RESC1608X55N]  (hidden comment: MCWR06X27R0FTL)
R36  value 10k  [RESC1608X06L]  (hidden comment: MCMR06X1002FTL)
R37  value 10k  [RESC1608X06L]  (hidden comment: MCMR06X1002FTL)
U6  10M08SAE144  [SQFP50P2200X2200X165_HS-145N]  (parts C,D,E,F,G,H,I,J of 13)
U7  FT234XD  [SON45P300X90_HS-13N]
X1  value 50 MHz  [SPXO SG-210STF]  (hidden comment: X1G0041710047)

### Ports
ENC_A[1..3], ENC_B[1..3], ENC_Z[1..3], LEDB[1..3], LEDG[1..3], LEDR[1..3], PWM_AH[1..3], PWM_AL[1..3], PWM_BH[1..3], PWM_BL[1..3], PWM_CH[1..3], PWM_CL[1..3], StatusLED_B, StatusLED_R

### Nets
GND: C22.1 C23.1 C43.1 C45.1 C65.1 J10.1 J10.2 J10.3 J10.4 J10.37 J10.38 J10.39 J10.40 J11.5(GND) J11.SH(SHIELD) R37.1 U7.5(GND) U7.13(GND_PAD) X1.2(GND)
VCC: C43.2 C45.2 C65.2 U7.2(~{RESET}) U7.3(3V3OUT) U7.4(VCC) U7.9(VCCIO) X1.1(~{ST}) X1.4(VCC)
~{CTS}: U6.50(IO_3_50/DIFFIO_TX_RX_B9N) U7.11(~{CTS})
~{RTS}: U6.90(IO_6_90/CLK3P/DIFFIO_RX_R16P) U7.8(~{RTS})
CLK_50: U6.88(IO_6_88/CLK2P/DIFFIO_RX_R14P) X1.3(CLKout)
ENC_A1: U6.93(IO_6_93/DIFFIO_RX_R18N)
ENC_A2: U6.97(IO_6_97/VREFB6N0)
ENC_A3: U6.100(IO_6_100/DIFFIO_RX_R28P)
ENC_B1: U6.92(IO_6_92/DIFFIO_RX_R18P)
ENC_B2: U6.98(IO_6_98/DPCLK2/DIFFIO_RX_R26N)
ENC_B3: U6.101(IO_6_101/DIFFIO_RX_R27N)
ENC_Z1: U6.96(IO_6_96/DPCLK3/DIFFIO_RX_R26P)
ENC_Z2: U6.99(IO_6_99/DIFFIO_RX_R27P)
ENC_Z3: U6.102(IO_6_102/DIFFIO_RX_R28N)
GPIO5: J10.5 U6.54(IO_3_54/DIFFIO_TX_RX_B10N)
GPIO6: J10.6 U6.89(IO_6_89/CLK2N/DIFFIO_RX_R14N)
GPIO7: J10.7 U6.55(IO_3_55/DIFFIO_TX_RX_B12N)
GPIO8: J10.8 U6.87(IO_5_87/DIFFIO_RX_R10N)
GPIO9: J10.9 U6.56(IO_3_56/DIFFIO_TX_RX_B12P)
GPIO10: J10.10 U6.86(IO_5_86/DIFFIO_RX_R11N)
GPIO11: J10.11 U6.57(IO_3_57/DIFFIO_TX_RX_B14N)
GPIO12: J10.12 U6.85(IO_5_85/DIFFIO_RX_R10P)
GPIO13: J10.13 U6.58(IO_3_58/DIFFIO_TX_RX_B14P)
GPIO14: J10.14 U6.84(IO_5_84/DIFFIO_RX_R11P)
GPIO15: J10.15 U6.59(IO_3_59/DIFFIO_TX_RX_B16N)
GPIO16: J10.16 U6.81(IO_5_81/DIFFIO_RX_R7N)
GPIO17: J10.17 U6.60(IO_3_60/DIFFIO_TX_RX_B16P)
GPIO18: J10.18 U6.80(IO_5_80/VREFB5N0)
GPIO19: J10.19 U6.61(IO_4_61/VREFB4N0)
GPIO20: J10.20 U6.79(IO_5_79/DIFFIO_RX_R7P)
GPIO21: J10.21 U6.62(IO_4_62/DIFFIO_TX_RX_B20P)
GPIO22: J10.22 U6.78(IO_5_78)
GPIO23: J10.23 U6.64(IO_4_64/DIFFIO_TX_RX_B23N)
GPIO24: J10.24 U6.77(IO_5_77/DIFFIO_RX_R1N)
GPIO25: J10.25 U6.65(IO_4_65/DIFFIO_TX_RX_B23P)
GPIO26: J10.26 U6.76(IO_5_76/DIFFIO_RX_R2N)
GPIO27: J10.27 U6.66(IO_4_66/DIFFIO_TX_RX_B25N)
GPIO28: J10.28 U6.75(IO_5_75/DIFFIO_RX_R1P)
GPIO29: J10.29 U6.69(IO_4_69/DIFFIO_TX_RX_B27N)
GPIO30: J10.30 U6.74(IO_5_74/DIFFIO_RX_R2P)
GPIO31: U6.70(IO_4_70/DIFFIO_TX_RX_B27P)
LEDB1: U6.123(IO_8_123/VREFB8N0)
LEDB2: U6.132(IO_8_132/DIFFIO_RX_T22P)
LEDB3: U6.127(IO_8_127/DIFFIO_RX_T19N)
LEDG1: U6.124(IO_8_124/DIFFIO_RX_T19P)
LEDG2: U6.135(IO_8_135/DIFFIO_RX_T23N)
LEDG3: U6.130(IO_8_130/DIFFIO_RX_T20P)
LEDR1: U6.120(IO_8_120/DIFFIO_RX_T16P)
LEDR2: U6.131(IO_8_131/DIFFIO_RX_T20N)
LEDR3: U6.140(IO_8_140/DIFFIO_RX_T26P)
PWM_AH1: U6.48(IO_3_48/VREFB3N0)
PWM_AH2: U6.41(IO_3_41/DIFFIO_TX_RX_B3N)
PWM_AH3: U6.113(IO_7_113/DIFFIO_RX_T4N)
PWM_AL1: U6.47(IO_3_47/DIFFIO_TX_RX_B7P)
PWM_AL2: U6.39(IO_3_39/DIFFIO_TX_RX_B1P)
PWM_AL3: U6.112(IO_7_112/VREFB7N0)
PWM_BH1: U6.46(IO_3_46/DIFFIO_TX_RX_B7N)
PWM_BH2: U6.38(IO_3_38/DIFFIO_TX_RX_B1N)
PWM_BH3: U6.111(IO_7_111/DIFFIO_RX_T1N)
PWM_BL1: U6.45(IO_3_45/DIFFIO_TX_RX_B5P)
PWM_BL2: U6.119(IO_7_119/DIFFIO_RX_T10N)
PWM_BL3: U6.110(IO_7_110/DIFFIO_RX_T1P)
PWM_CH1: U6.44(IO_3_44/DIFFIO_TX_RX_B5N)
PWM_CH2: U6.118(IO_7_118/DIFFIO_RX_T10P)
PWM_CH3: U6.106(IO_6_106/DIFFIO_RX_R33N)
PWM_CL1: U6.43(IO_3_43/DIFFIO_TX_RX_B3P)
PWM_CL2: U6.114(IO_7_114/DIFFIO_RX_T6P)
PWM_CL3: U6.105(IO_6_105/DIFFIO_RX_R33P)
RXD: U6.52(IO_3_52/DIFFIO_TX_RX_B9P) U7.10(RXD)
SGPIO31: J10.31 U6.29(IO_2_29/CLK1P/DIFFIO_RX_L20P)
SGPIO32: J10.32 U6.27(IO_2_27/CLK0P/DIFFIO_RX_L18P)
SGPIO33: J10.33 U6.32(IO_2_32/PLL_L_CLKOUTN/DIFFIO_RX_L27N)
SGPIO34: J10.34 U6.28(IO_2_28/CLK1N/DIFFIO_RX_L20N)
SGPIO35: J10.35 U6.33(IO_2_33/PLL_L_CLKOUTP/DIFFIO_RX_L27P)
SGPIO36: J10.36 U6.30(IO_2_30/VREFB2N0)
StatusLED_B: U6.141(IO_8_141/DIFFIO_RX_T26N) ; port StatusLED_B
StatusLED_R: U6.26(IO_2_26/CLK0N/DIFFIO_RX_L18N) ; port StatusLED_R
TXD: U6.91(IO_6_91/CLK3N/DIFFIO_RX_R16N) U7.7(TXD)
USB_N: C22.2 J11.2(D-) R34.2
USB_P: C23.2 J11.3(D+) R35.2
NetJ11_1: J11.1(VCC) R36.2
NetR34_1: R34.1 U7.1(USBDM)
NetR35_1: R35.1 U7.12(USBDP)
NetR36_1: R36.1 R37.2 U7.6(CBUS0)

Not connected (* = marked no-connect by the designer): J11 4(ID); U6 17(IO_1B_17/VREFB1N0)

### Buses and harness runs
bus ENC_A[1..3] = port ENC_A[1..3]
bus ENC_B[1..3] = port ENC_B[1..3]
bus ENC_Z[1..3] = port ENC_Z[1..3]
bus LEDB[1..3] = port LEDB[1..3]
bus LEDG[1..3] = port LEDG[1..3]
bus LEDR[1..3] = port LEDR[1..3]
bus PWM_AH[1..3] = port PWM_AH[1..3]
bus PWM_AL[1..3] = port PWM_AL[1..3]
bus PWM_BH[1..3] = port PWM_BH[1..3]
bus PWM_BL[1..3] = port PWM_BL[1..3]
bus PWM_CH[1..3] = port PWM_CH[1..3]
bus PWM_CL[1..3] = port PWM_CL[1..3]

### Layout directives
differential pair: USB_N, USB_P

### Notes on the sheet
- (near FID1) Place close to FPGA package
- (near FID1) Local fiducial
- (in symbol 10M08SAE144, part C) MAX10 10M08SAE144 / VERSION : 1.0 / PAGE : 3 of 13 / DATE : SEPT_ 2014 /
- (in symbol 10M08SAE144, part D) MAX10 10M08SAE144 / VERSION : 1.0 / PAGE : 4 of 13 / DATE : SEPT_ 2014 /
- (in symbol 10M08SAE144, part E) MAX10 10M08SAE144 / VERSION : 1.0 / PAGE : 5 of 13 / DATE : SEPT_ 2014 /
- (in symbol 10M08SAE144, part F) MAX10 10M08SAE144 / VERSION : 1.0 / PAGE : 6 of 13 / DATE : SEPT_ 2014 /
- (in symbol 10M08SAE144, part G) MAX10 10M08SAE144 / VERSION : 1.0 / PAGE : 7 of 13 / DATE : SEPT_ 2014 /
- (in symbol 10M08SAE144, part H) MAX10 10M08SAE144 / VERSION : 1.0 / PAGE : 8 of 13 / DATE : SEPT_ 2014 /
- (in symbol 10M08SAE144, part I) MAX10 10M08SAE144 / VERSION : 1.0 / PAGE : 9 of 13 / DATE : SEPT_ 2014 /
- (in symbol 10M08SAE144, part J) MAX10 10M08SAE144 / VERSION : 1.0 / PAGE : 10 of 13 / DATE : SEPT_ 2014 /

### Library data of the parts
C22 C23 = MC0603N470J500CT: CAP, MLCC, C0G/NP0, 47PF, 50V, 0603; Supplier 1: Farnell; Supplier Part Number 1: 1759062
C43 C65 = MC0603B104K160CT: CAP, MLCC, X7R, 100NF, 16V, 0603; Supplier 1: Farnell; Supplier Part Number 1: 2310628; Supplier 2: Farnell; Supplier Part Number 2: 1759016RL; Supplier 3: Farnell; Supplier Part Number 3: 1759016
C45 = MC0603X105K160: CAP, MLCC, X5R, 1UF, 16V, 0603; Supplier 1: Farnell; Supplier Part Number 1: 2310630; Supplier 2: Farnell; Supplier Part Number 2: 1759407RL; Supplier 3: Farnell; Supplier Part Number 3: 1759407
FID1 = FIDUCIAL: as FID2 on sheet Top
J10 = Header 20X2: Header, 20-Pin, Dual row; LatestRevisionDate: 17-Jul-2002; LatestRevisionNote: Re-released for DXP Platform.; Publisher: Altium Limited
J11 = 10103594-0001LF: MICRO USB B, RECEPTACLE, SMT, RA, 5WAY
R34 R35 = MCWR06X27R0FTL: RES, THICK FILM, 27OHM, 1%, 0.1W; Supplier 1: Farnell; Supplier Part Number 1: 2447316
R36 R37 = MCMR06X1002FTL: Resistor, 10k, 0603; Supplier 1: Farnell; Supplier Part Number 1: 2073349; Supplier 2: Farnell; Supplier Part Number 2: 2073349RL
U6 = 10M08SAE144: as U6 on sheet Analouge
X1 = X1G0041710047: OSCILLATOR, SPXO, SG-210STF, 50 MHZ, SMD; Supplier 1: Farnell; Supplier Part Number 1: 2405741RL; Supplier 2: Farnell; Supplier Part Number 2: 2405741; Supplier 3: Farnell; Supplier Part Number 3: 2428451
U7 = FT234XD: Supplier 1: Farnell; Supplier Part Number 1: 2419911

## Sheet Config.SchDoc
size A3; DocumentNumber: 7; SheetNumber: 7; SheetTotal: 8
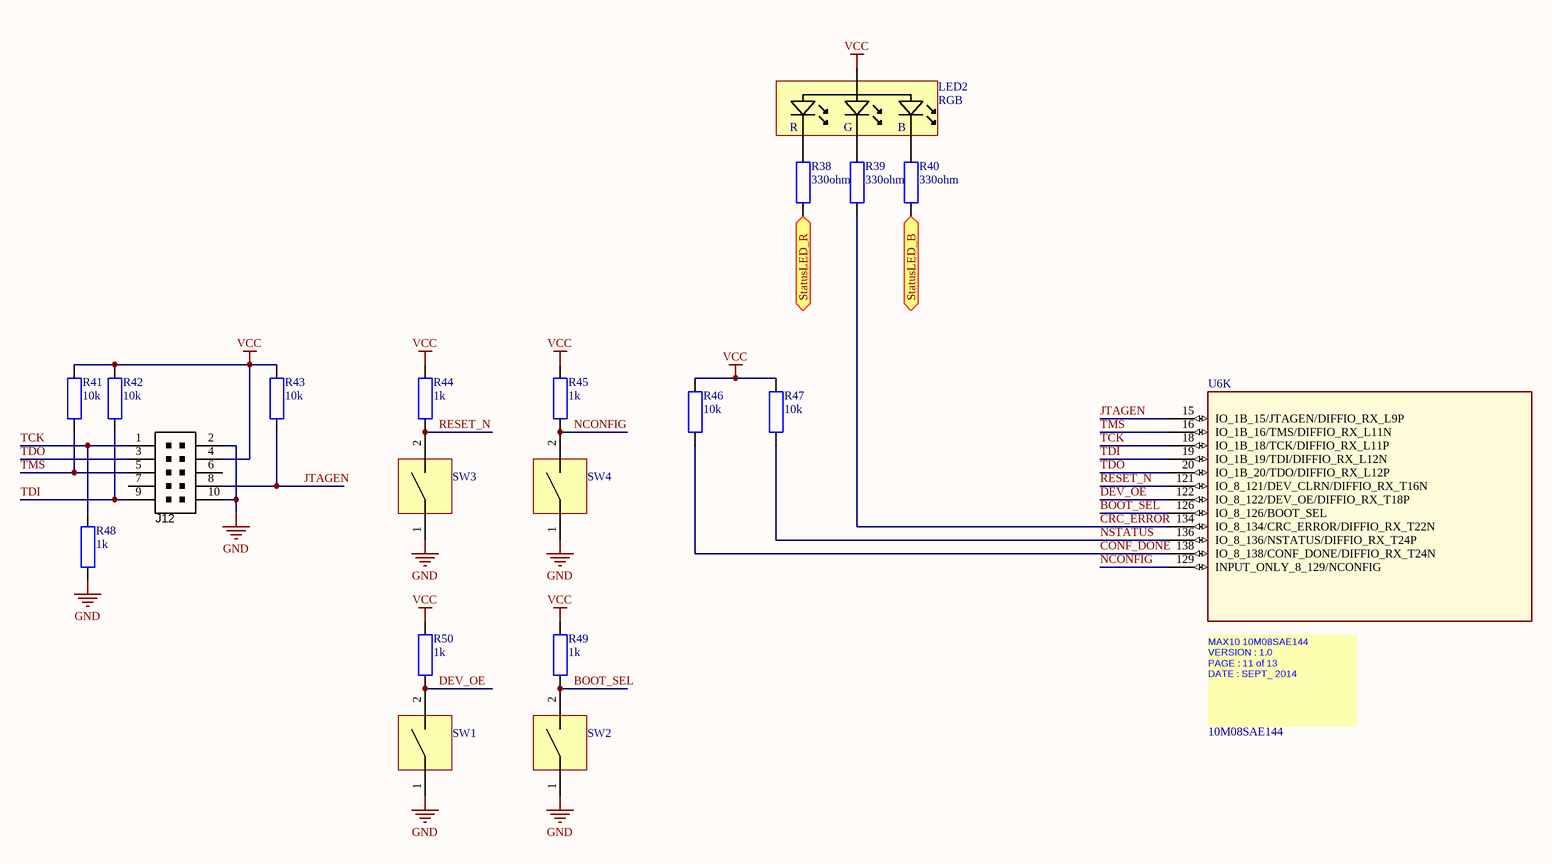
[diagram p5: Config.SchDoc]

### Parts
J12  shrouded box header  [10P_PCB_HEADER_BRD_MNT]  (value not drawn)
LED2  RGB  [ASMB-MTB1]
R38  value 330ohm  [RESC1608X06L]  (hidden comment: MCWR06X3300FTL)
R39  value 330ohm  [RESC1608X06L]  (hidden comment: MCWR06X3300FTL)
R40  value 330ohm  [RESC1608X06L]  (hidden comment: MCWR06X3300FTL)
R41  value 10k  [RESC1608X06L]  (hidden comment: MCMR06X1002FTL)
R42  value 10k  [RESC1608X06L]  (hidden comment: MCMR06X1002FTL)
R43  value 10k  [RESC1608X06L]  (hidden comment: MCMR06X1002FTL)
R44  value 1k  [RESC1608X55N]  (hidden comment: MCMR06X1001FTL)
R45  value 1k  [RESC1608X55N]  (hidden comment: MCMR06X1001FTL)
R46  value 10k  [RESC1608X06L]  (hidden comment: MCMR06X1002FTL)
R47  value 10k  [RESC1608X06L]  (hidden comment: MCMR06X1002FTL)
R48  value 1k  [RESC1608X55N]  (hidden comment: MCMR06X1001FTL)
R49  value 1k  [RESC1608X55N]  (hidden comment: MCMR06X1001FTL)
R50  value 1k  [RESC1608X55N]  (hidden comment: MCMR06X1001FTL)
SW1  FSM4JH  [FSM4JH]  (value not drawn)
SW2  FSM4JH  [FSM4JH]  (value not drawn)
SW3  FSM4JH  [FSM4JH]  (value not drawn)
SW4  FSM4JH  [FSM4JH]  (value not drawn)
U6  10M08SAE144  [SQFP50P2200X2200X165_HS-145N]  (part K of 13)

### Ports
StatusLED_B, StatusLED_R

### Nets
GND: J12.2 J12.10 R48.1 SW1.1 SW2.1 SW3.1 SW4.1
VCC: J12.4 LED2.4(A) R41.2 R42.2 R43.2 R44.2 R45.2 R46.2 R47.2 R49.2 R50.2
BOOT_SEL: R49.1 SW2.2 U6.126(IO_8_126/BOOT_SEL)
CONF_DONE: R46.1 U6.138(IO_8_138/CONF_DONE/DIFFIO_RX_T24N)
CRC_ERROR: R39.2 U6.134(IO_8_134/CRC_ERROR/DIFFIO_RX_T22N)
DEV_OE: R50.1 SW1.2 U6.122(IO_8_122/DEV_OE/DIFFIO_RX_T18P)
JTAGEN: J12.8 R43.1 U6.15(IO_1B_15/JTAGEN/DIFFIO_RX_L9P)
NCONFIG: R45.1 SW4.2 U6.129(INPUT_ONLY_8_129/NCONFIG)
NSTATUS: R47.1 U6.136(IO_8_136/NSTATUS/DIFFIO_RX_T24P)
RESET_N: R44.1 SW3.2 U6.121(IO_8_121/DEV_CLRN/DIFFIO_RX_T16N)
StatusLED_B: R40.2 ; port StatusLED_B
StatusLED_R: R38.2 ; port StatusLED_R
TCK: J12.1 R48.2 U6.18(IO_1B_18/TCK/DIFFIO_RX_L11P)
TDI: J12.9 R42.1 U6.19(IO_1B_19/TDI/DIFFIO_RX_L12N)
TDO: J12.3 U6.20(IO_1B_20/TDO/DIFFIO_RX_L12P)
TMS: J12.5 R41.1 U6.16(IO_1B_16/TMS/DIFFIO_RX_L11N)
NetLED2_1: LED2.1(R) R38.1
NetLED2_2: LED2.2(G) R39.1
NetLED2_3: LED2.3(B) R40.1

Not connected (* = marked no-connect by the designer): J12 6 7

### Notes on the sheet
- (in symbol 10M08SAE144, part K) MAX10 10M08SAE144 / VERSION : 1.0 / PAGE : 11 of 13 / DATE : SEPT_ 2014 /

### Library data of the parts
J12 = CONN_HEADER_2x5P_0.100in_Male: Header THD 10 POS Double-row 2.54mm pitch; Manufacturer 1: 3M; Manufacturer Part Number 1: D2510-6002-AR; Pitch: 0.100" (2.54mm); Value: Double-row, 10 positions; QtyOverride: 1; Connector Type: Header, Shrouded; Number of Positions: 10; SCDType: undef; Package / Case: Connector header; 2.54mm pitch; Contact Type: Male Pin; Number of Rows: 2; Row Spacing: 0.100" (2.54mm); Contact Mating Length: 0.243" (6.17mm); ComponentLink1URL: http://multimedia.3m.com/mws/mediawebserver?66666UuZjcFSLXTtm8T_oxMcEVuQEcuZgVs6EVs6E666666--; ComponentLink1Description: http://multimedia.3m.com/mws/mediawebserver?66666UuZjcFSLXTtm8T_oxMcEVuQEcuZgVs6EVs6E666666--; Supplier 1: Digi-Key; Supplier Part Number 1: MHC10E-ND
LED2 = ASMB-MTB1-0A3A2: LED, HB, RGB, 0.09W, PLCC-4; Supplier 1: Farnell; Supplier Part Number 1: 2401106
R38-R40 = MCWR06X3300FTL: RES, THICK FILM, 330 OHM, 1%, 0.1W; Supplier 1: Farnell; Supplier Part Number 1: 2447339RL; Supplier 2: Farnell; Supplier Part Number 2: 2446656; Supplier 3: Farnell; Supplier Part Number 3: 2447339
R41-R43 R46 R47 = MCMR06X1002FTL: Resistor, 10k, 0603; Supplier 1: Farnell; Supplier Part Number 1: 2073349; Supplier 2: Farnell; Supplier Part Number 2: 2073349RL
R44 R45 R48-R50 = MCMR06X1001FTL: RESISTOR, CERAMIC, 1K, 0.1W, 1%; Supplier 1: Farnell; Supplier Part Number 1: 2073348; Supplier 2: Farnell; Supplier Part Number 2: 2073348RL
SW1-SW4 = FSM4JH: SWITCH, SPNO, 0.05A; Supplier 1: Farnell; Supplier Part Number 1: 1555982
U6 = 10M08SAE144: as U6 on sheet Analouge

## Sheet Power.SchDoc
size A3; DocumentNumber: 8; SheetNumber: 8; SheetTotal: 8
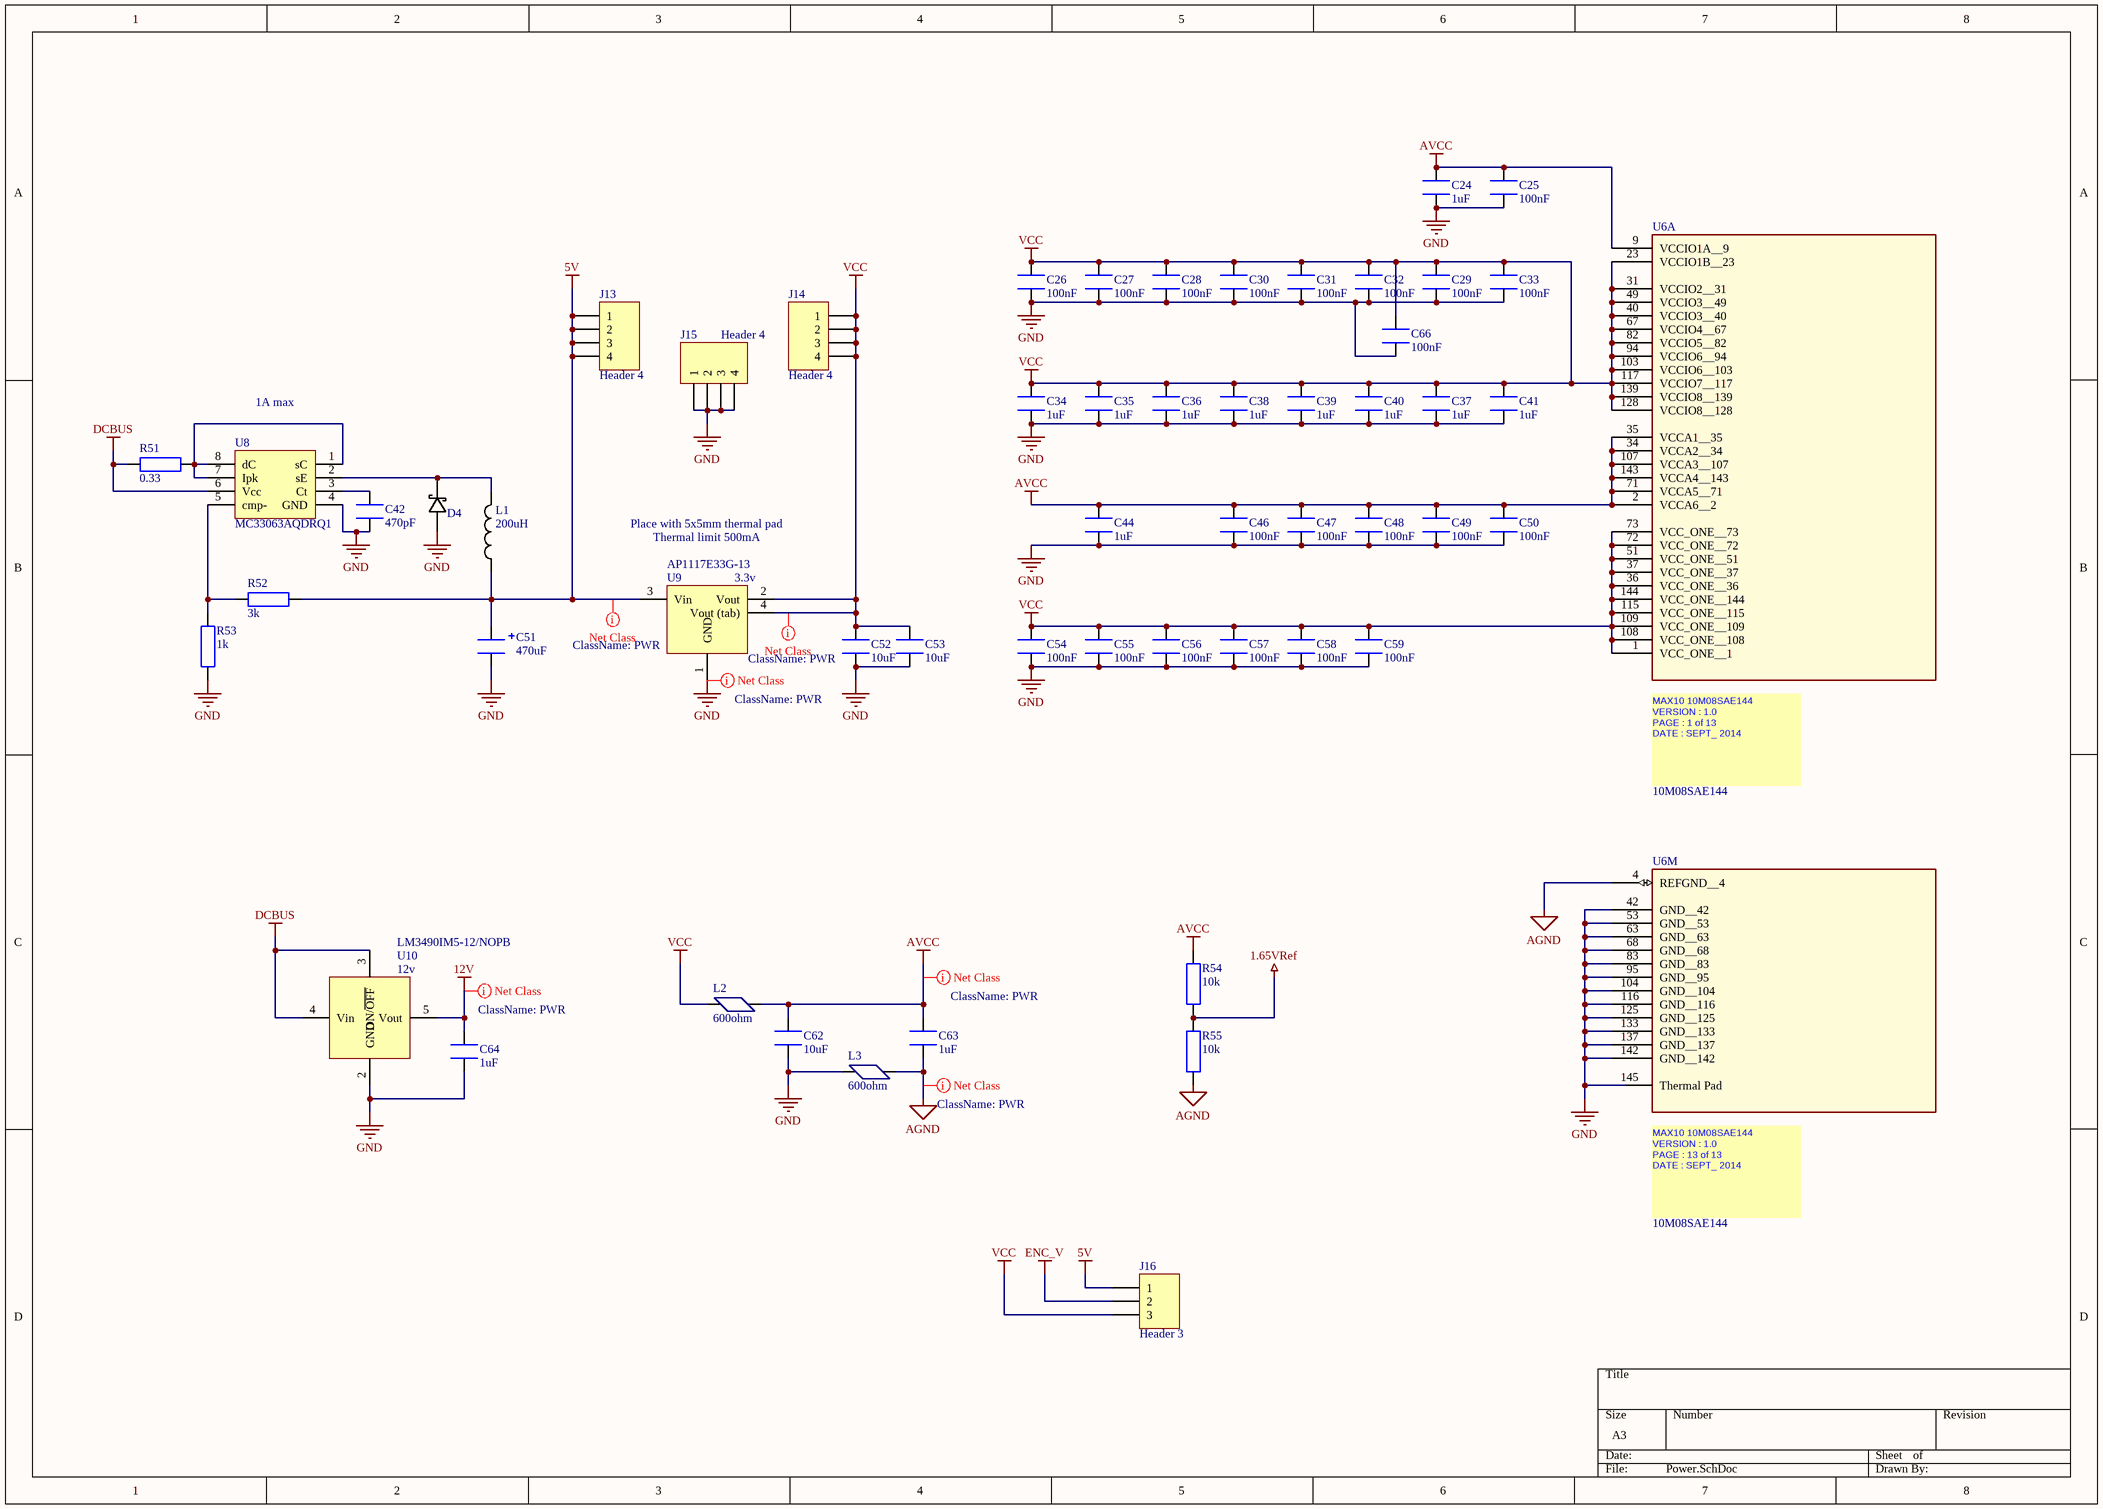
[diagram p6: Power.SchDoc]

### Parts
C24  value 1uF  [1608[0603]]  (hidden comment: MC0603X105K160)
C25  value 100nF  [1608[0603]]  (hidden comment: MC0603B104K160CT)
C26  value 100nF  [1608[0603]]  (hidden comment: MC0603B104K160CT)
C27  value 100nF  [1608[0603]]  (hidden comment: MC0603B104K160CT)
C28  value 100nF  [1608[0603]]  (hidden comment: MC0603B104K160CT)
C29  value 100nF  [1608[0603]]  (hidden comment: MC0603B104K160CT)
C30  value 100nF  [1608[0603]]  (hidden comment: MC0603B104K160CT)
C31  value 100nF  [1608[0603]]  (hidden comment: MC0603B104K160CT)
C32  value 100nF  [1608[0603]]  (hidden comment: MC0603B104K160CT)
C33  value 100nF  [1608[0603]]  (hidden comment: MC0603B104K160CT)
C34  value 1uF  [1608[0603]]  (hidden comment: MC0603X105K160)
C35  value 1uF  [1608[0603]]  (hidden comment: MC0603X105K160)
C36  value 1uF  [1608[0603]]  (hidden comment: MC0603X105K160)
C37  value 1uF  [1608[0603]]  (hidden comment: MC0603X105K160)
C38  value 1uF  [1608[0603]]  (hidden comment: MC0603X105K160)
C39  value 1uF  [1608[0603]]  (hidden comment: MC0603X105K160)
C40  value 1uF  [1608[0603]]  (hidden comment: MC0603X105K160)
C41  value 1uF  [1608[0603]]  (hidden comment: MC0603X105K160)
C42  value 470pF  [1608[0603]]  (hidden comment: MC0603B471K500CT)
C44  value 1uF  [1608[0603]]  (hidden comment: MC0603X105K160)
C46  value 100nF  [1608[0603]]  (hidden comment: MC0603B104K160CT)
C47  value 100nF  [1608[0603]]  (hidden comment: MC0603B104K160CT)
C48  value 100nF  [1608[0603]]  (hidden comment: MC0603B104K160CT)
C49  value 100nF  [1608[0603]]  (hidden comment: MC0603B104K160CT)
C50  value 100nF  [1608[0603]]  (hidden comment: MC0603B104K160CT)
C51  value 470uF  [CAP_ELEC_SIZE_G]  (hidden comment: EEE1CA471P)
C52  value 10uF  [CAPC2012X135N]  (hidden comment: MC0805F106Z100CT)
C53  value 10uF  [CAPC2012X135N]  (hidden comment: MC0805F106Z100CT)
C54  value 100nF  [1608[0603]]  (hidden comment: MC0603B104K160CT)
C55  value 100nF  [1608[0603]]  (hidden comment: MC0603B104K160CT)
C56  value 100nF  [1608[0603]]  (hidden comment: MC0603B104K160CT)
C57  value 100nF  [1608[0603]]  (hidden comment: MC0603B104K160CT)
C58  value 100nF  [1608[0603]]  (hidden comment: MC0603B104K160CT)
C59  value 100nF  [1608[0603]]  (hidden comment: MC0603B104K160CT)
C62  value 10uF  [CAPC2012X135N]  (hidden comment: MC0805F106Z100CT)
C63  value 1uF  [1608[0603]]  (hidden comment: MC0603X105K160)
C64  value 1uF  [1608[0603]]  (hidden comment: MC0603X105K160)
C66  value 100nF  [1608[0603]]  (hidden comment: MC0603B104K160CT)
D4  SS13B  [DO-214AA]  (value not drawn)
J13  Header 4  [HDR1X4]
J14  Header 4  [HDR1X4]
J15  Header 4  [HDR1X4]
J16  Header 3  [HDR1X3]
L1  value 200uH  [Inductor 12x12mm]  (hidden comment: MCSDRH125B-221MHF)
L2  value 600ohm  [FBC2012N]  (hidden comment: 2508056017Y2)
L3  value 600ohm  [FBC2012N]  (hidden comment: 2508056017Y2)
R51  value 0.33  [RESC1608X55N]  (hidden comment: ERJ3RQFR33V)
R52  value 3k  [RESC1608X55N]  (hidden comment: MCMR06X3001FTL)
R53  value 1k  [RESC1608X55N]  (hidden comment: MCMR06X1001FTL)
R54  value 10k  [RESC1608X06L]  (hidden comment: MCMR06X1002FTL)
R55  value 10k  [RESC1608X06L]  (hidden comment: MCMR06X1002FTL)
U6  10M08SAE144  [SQFP50P2200X2200X165_HS-145N]  (parts A,M of 13)
U8  MC33063AQDRQ1  [SO8_N]
U9  AP1117E33G-13  value 3.3v  [SOT223]
U10  LM3490IM5-12/NOPB  value 12v  [SOT23-5]

### Nets
1.65VRef: R54.1 R55.2
5V: C51.1 J13.1 J13.2 J13.3 J13.4 J16.1 L1.1 R52.1 U9.3(Vin)
12V: C64.2 U10.5(Vout)
AGND: C63.1 L3.1 R55.1 U6.4(REFGND__4)
AVCC: C24.2 C25.2 C44.2 C46.2 C47.2 C48.2 C49.2 C50.2 C62.2 C63.2 L2.1 R54.2 U6.2(VCCA6__2) U6.9(VCCIO1A__9) U6.34(VCCA2__34) U6.35(VCCA1__35) U6.71(VCCA5__71) U6.107(VCCA3__107) U6.143(VCCA4__143)
DCBUS: R51.2 U8.6(Vcc) U10.3(ON/~{OFF}) U10.4(Vin)
ENC_V: J16.2
GND: C24.1 C25.1 C26.1 C27.1 C28.1 C29.1 C30.1 C31.1 C32.1 C33.1 C34.1 C35.1 C36.1 C37.1 C38.1 C39.1 C40.1 C41.1 C42.1 C44.1 C46.1 C47.1 C48.1 C49.1 C50.1 C51.2 C52.1 C53.1 C54.1 C55.1 C56.1 C57.1 C58.1 C59.1 C62.1 C64.1 C66.1 D4.A J15.1 J15.2 J15.3 J15.4 L3.2 R53.1 U6.42(GND__42) U6.53(GND__53) U6.63(GND__63) U6.68(GND__68) U6.83(GND__83) U6.95(GND__95) U6.104(GND__104) U6.116(GND__116) U6.125(GND__125) U6.133(GND__133) U6.137(GND__137) U6.142(GND__142) U6.145(Thermal_Pad) U8.4(GND) U9.1(GND) U10.2(GND)
VCC: C26.2 C27.2 C28.2 C29.2 C30.2 C31.2 C32.2 C33.2 C34.2 C35.2 C36.2 C37.2 C38.2 C39.2 C40.2 C41.2 C52.2 C53.2 C54.2 C55.2 C56.2 C57.2 C58.2 C59.2 C66.2 J14.1 J14.2 J14.3 J14.4 J16.3 L2.2 U6.1(VCC_ONE__1) U6.23(VCCIO1B__23) U6.31(VCCIO2__31) U6.36(VCC_ONE__36) U6.37(VCC_ONE__37) U6.40(VCCIO3__40) U6.49(VCCIO3__49) U6.51(VCC_ONE__51) U6.67(VCCIO4__67) U6.72(VCC_ONE__72) U6.73(VCC_ONE__73) U6.82(VCCIO5__82) U6.94(VCCIO6__94) U6.103(VCCIO6__103) U6.108(VCC_ONE__108) U6.109(VCC_ONE__109) U6.115(VCC_ONE__115) U6.117(VCCIO7__117) U6.128(VCCIO8__128) U6.139(VCCIO8__139) U6.144(VCC_ONE__144) U9.2(Vout) U9.4(Vout_(tab))
NetC42_2: C42.2 U8.3(Ct)
NetD4_K: D4.K L1.2 U8.2(sE)
NetR51_1: R51.1 U8.1(sC) U8.7(Ipk) U8.8(dC)
NetR52_2: R52.2 R53.2 U8.5(cmp-)

### Layout directives
net class PWR: 5V, 12V, AGND, AVCC, GND, VCC

### Notes on the sheet
- 1A max
- Place with 5x5mm thermal pad
- Thermal limit 500mA
- (in symbol 10M08SAE144, part A) MAX10 10M08SAE144 / VERSION : 1.0 / PAGE : 1 of 13 / DATE : SEPT_ 2014 /
- (in symbol 10M08SAE144, part M) MAX10 10M08SAE144 / VERSION : 1.0 / PAGE : 13 of 13 / DATE : SEPT_ 2014 /

### Library data of the parts
C24 C34-C41 C44 C63 C64 = MC0603X105K160: CAP, MLCC, X5R, 1UF, 16V, 0603; Supplier 1: Farnell; Supplier Part Number 1: 2310630; Supplier 2: Farnell; Supplier Part Number 2: 1759407RL; Supplier 3: Farnell; Supplier Part Number 3: 1759407
C25-C33 C46-C50 C54-C59 C66 = MC0603B104K160CT: CAP, MLCC, X7R, 100NF, 16V, 0603; Supplier 1: Farnell; Supplier Part Number 1: 2310628; Supplier 2: Farnell; Supplier Part Number 2: 1759016RL; Supplier 3: Farnell; Supplier Part Number 3: 1759016
C42 = MC0603B471K500CT: CAP, MLCC, X7R, 470PF, 50V, 0603; Supplier 1: Farnell; Supplier Part Number 1: 1759079RL; Supplier 2: Farnell; Supplier Part Number 2: 2310617; Supplier 3: Farnell; Supplier Part Number 3: 1759079
C51 = EEE1CA471P: CAP, ALU ELEC, 470UF, 16V, SMD; Supplier 1: Farnell; Supplier Part Number 1: 2326123RL; Supplier 2: Farnell; Supplier Part Number 2: 2326123
C52 C53 C62 = MC0805F106Z100CT: CAP, MLCC, Y5V, 10UF, 0805; Supplier 1: Farnell; Supplier Part Number 1: 2408565; Supplier 2: Farnell; Supplier Part Number 2: 1759421; Supplier 3: Farnell; Supplier Part Number 3: 1759421RL; Supplier 4: Farnell; Supplier Part Number 4: 1760155
D4 = SS13B: DIODE, SCHOTTK, RECTIF, 1A, 30V, SMB; Supplier 1: Farnell; Supplier Part Number 1: 1861425
J13-J15 = Header 4: Header, 4-Pin; LatestRevisionDate: 17-Jul-2002; LatestRevisionNote: Re-released for DXP Platform.; Publisher: Altium Limited
J16 = Header 3: Header, 3-Pin; LatestRevisionDate: 17-Jul-2002; LatestRevisionNote: Re-released for DXP Platform.; Publisher: Altium Limited
L1 = MCSDRH125B-221MHF: INDUCTOR, 220µH, 20%, 2PINS; Supplier 1: Farnell; Supplier Part Number 1: 1864461RL; Supplier 2: Farnell; Supplier Part Number 2: 1864461
L2 L3 = 2508056017Y2: FERRITE BEAD, 0.1OHM, 2A, 0805; Supplier 1: Farnell; Supplier 2: Farnell; Supplier Part Number 1: 1838838; Supplier Part Number 2: 1838838RL
R51 = ERJ3RQFR33V: RESISTOR, 0603, 0.1W, 1%, 0R33; Supplier 1: Farnell; Supplier Part Number 1: 1717766RL; Supplier 2: Farnell; Supplier Part Number 2: 1717766
R52 = MCMR06X3001FTL: RESISTOR, 0603, 3K, 1%, ANTI SULFUR; Supplier 1: Farnell; Supplier Part Number 1: 2073461; Supplier 2: Farnell; Supplier Part Number 2: 2073461RL
R53 = MCMR06X1001FTL: RESISTOR, CERAMIC, 1K, 0.1W, 1%; Supplier 1: Farnell; Supplier Part Number 1: 2073348; Supplier 2: Farnell; Supplier Part Number 2: 2073348RL
R54 R55 = MCMR06X1002FTL: Resistor, 10k, 0603; Supplier 1: Farnell; Supplier Part Number 1: 2073349; Supplier 2: Farnell; Supplier Part Number 2: 2073349RL
U6 = 10M08SAE144: as U6 on sheet Analouge
U8 = MC33063AQDRQ1: DC-DC CONV, BOOST/BUCK/INVERTING, SOIC-8; Supplier 1: Farnell; Supplier Part Number 1: 2323541
U9 = AP1117E33G-13: IC, LDO, REG, 3.3V, SOT223; Supplier 1: Farnell; Supplier 2: Farnell; Supplier Part Number 1: 1825291RL; Supplier Part Number 2: 1825291
U10 = LM3490IM5-12/NOPB: LDO, FIXED, 12V, 0.1A, SOT-23-5; Supplier 1: Farnell; Supplier Part Number 1: 2382985

## Nets that join several sheets
1.65VRef: AUX/M1 (1U4.1 1U5.1), AUX/M2 (2U4.1 2U5.1), AUX/M3 (3U4.1 3U5.1), Power (R54.1 R55.2)
12V: AUX/M1 (9 pins), AUX/M2 (9 pins), AUX/M3 (9 pins), Power (C64.2 U10.5)
AGND: AuxhalfH (R20.1 R21.1), AUX/M1 (1C10.1 1C11.1 1U4.2 1U5.2), AUX/M2 (2C10.1 2C11.1 2U4.2 2U5.2), AUX/M3 (3C10.1 3C11.1 3U4.2 3U5.2), Analouge (11 pins), Power (C63.1 L3.1 R55.1 U6.4)
AVCC: AuxhalfH (R19.2), AUX/M1 (1C10.2 1C11.2 1U4.3 1U5.3), AUX/M2 (2C10.2 2C11.2 2U4.3 2U5.3), AUX/M3 (3C10.2 3C11.2 3U4.3 3U5.3), Analouge (R22.2), Power (19 pins)
DCBUS: AuxhalfH (J6.1 J8.1), AUX/M1 (9 pins), AUX/M2 (9 pins), AUX/M3 (9 pins), Analouge (R23.2), Power (R51.2 U8.6 U10.3 U10.4)
ENC_V: AUX/M1 (1J1.1), AUX/M2 (2J1.1), AUX/M3 (3J1.1), Power (J16.2)
GND: Top (MH2.1 MH3.1), AuxhalfH (J7.1 J8.2), AUX/M1 (27 pins), AUX/M2 (27 pins), AUX/M3 (27 pins), FPGA (19 pins), Config (7 pins), Power (60 pins)
VCC: AUX/M1 (1LED1.4), AUX/M2 (2LED1.4), AUX/M3 (3LED1.4), FPGA (9 pins), Config (11 pins), Power (54 pins)
ENC_A1: AUX/M1 (1J1.2), FPGA (U6.93)
ENC_A2: AUX/M2 (2J1.2), FPGA (U6.97)
ENC_A3: AUX/M3 (3J1.2), FPGA (U6.100)
ENC_B1: AUX/M1 (1J1.3), FPGA (U6.92)
ENC_B2: AUX/M2 (2J1.3), FPGA (U6.98)
ENC_B3: AUX/M3 (3J1.3), FPGA (U6.101)
ENC_Z1: AUX/M1 (1J1.4), FPGA (U6.96)
ENC_Z2: AUX/M2 (2J1.4), FPGA (U6.99)
ENC_Z3: AUX/M3 (3J1.4), FPGA (U6.102)
IA1: AUX/M1 (1U4.6), Analouge (R32.2)
IA2: AUX/M2 (2U4.6), Analouge (R30.2)
IA3: AUX/M3 (3U4.6), Analouge (R27.2)
IB1: AUX/M1 (1U5.6), Analouge (R31.2)
IB2: AUX/M2 (2U5.6), Analouge (R28.2)
IB3: AUX/M3 (3U5.6), Analouge (R26.2)
LEDB1: AUX/M1 (1R17.2), FPGA (U6.123)
LEDB2: AUX/M2 (2R17.2), FPGA (U6.132)
LEDB3: AUX/M3 (3R17.2), FPGA (U6.127)
LEDG1: AUX/M1 (1R16.2), FPGA (U6.124)
LEDG2: AUX/M2 (2R16.2), FPGA (U6.135)
LEDG3: AUX/M3 (3R16.2), FPGA (U6.130)
LEDR1: AUX/M1 (1R15.2), FPGA (U6.120)
LEDR2: AUX/M2 (2R15.2), FPGA (U6.131)
LEDR3: AUX/M3 (3R15.2), FPGA (U6.140)
NetR18_1: AuxhalfH (R18.1 R20.2), Analouge (R33.2)
NetR19_1: AuxhalfH (R19.1 R21.2), Analouge (R29.2)
PWM_AH1: AUX/M1 (1R1.2 1U1.2), FPGA (U6.48)
PWM_AH2: AUX/M2 (2R1.2 2U1.2), FPGA (U6.41)
PWM_AH3: AUX/M3 (3R1.2 3U1.2), FPGA (U6.113)
PWM_AL1: AUX/M1 (1R2.2 1U1.3), FPGA (U6.47)
PWM_AL2: AUX/M2 (2R2.2 2U1.3), FPGA (U6.39)
PWM_AL3: AUX/M3 (3R2.2 3U1.3), FPGA (U6.112)
PWM_BH1: AUX/M1 (1R3.2 1U2.2), FPGA (U6.46)
PWM_BH2: AUX/M2 (2R3.2 2U2.2), FPGA (U6.38)
PWM_BH3: AUX/M3 (3R3.2 3U2.2), FPGA (U6.111)
PWM_BL1: AUX/M1 (1R4.2 1U2.3), FPGA (U6.45)
PWM_BL2: AUX/M2 (2R4.2 2U2.3), FPGA (U6.119)
PWM_BL3: AUX/M3 (3R4.2 3U2.3), FPGA (U6.110)
PWM_CH1: AUX/M1 (1R5.2 1U3.2), FPGA (U6.44)
PWM_CH2: AUX/M2 (2R5.2 2U3.2), FPGA (U6.118)
PWM_CH3: AUX/M3 (3R5.2 3U3.2), FPGA (U6.106)
PWM_CL1: AUX/M1 (1R6.2 1U3.3), FPGA (U6.43)
PWM_CL2: AUX/M2 (2R6.2 2U3.3), FPGA (U6.114)
PWM_CL3: AUX/M3 (3R6.2 3U3.3), FPGA (U6.105)
StatusLED_B: FPGA (U6.141), Config (R40.2)
StatusLED_R: FPGA (U6.26), Config (R38.2)